# EAGLE design VentilationsEvaluationDevBoard_v2.1.3 (EAGLE 9.6.2)
TEST: 1234

## Sheet 1 of 3
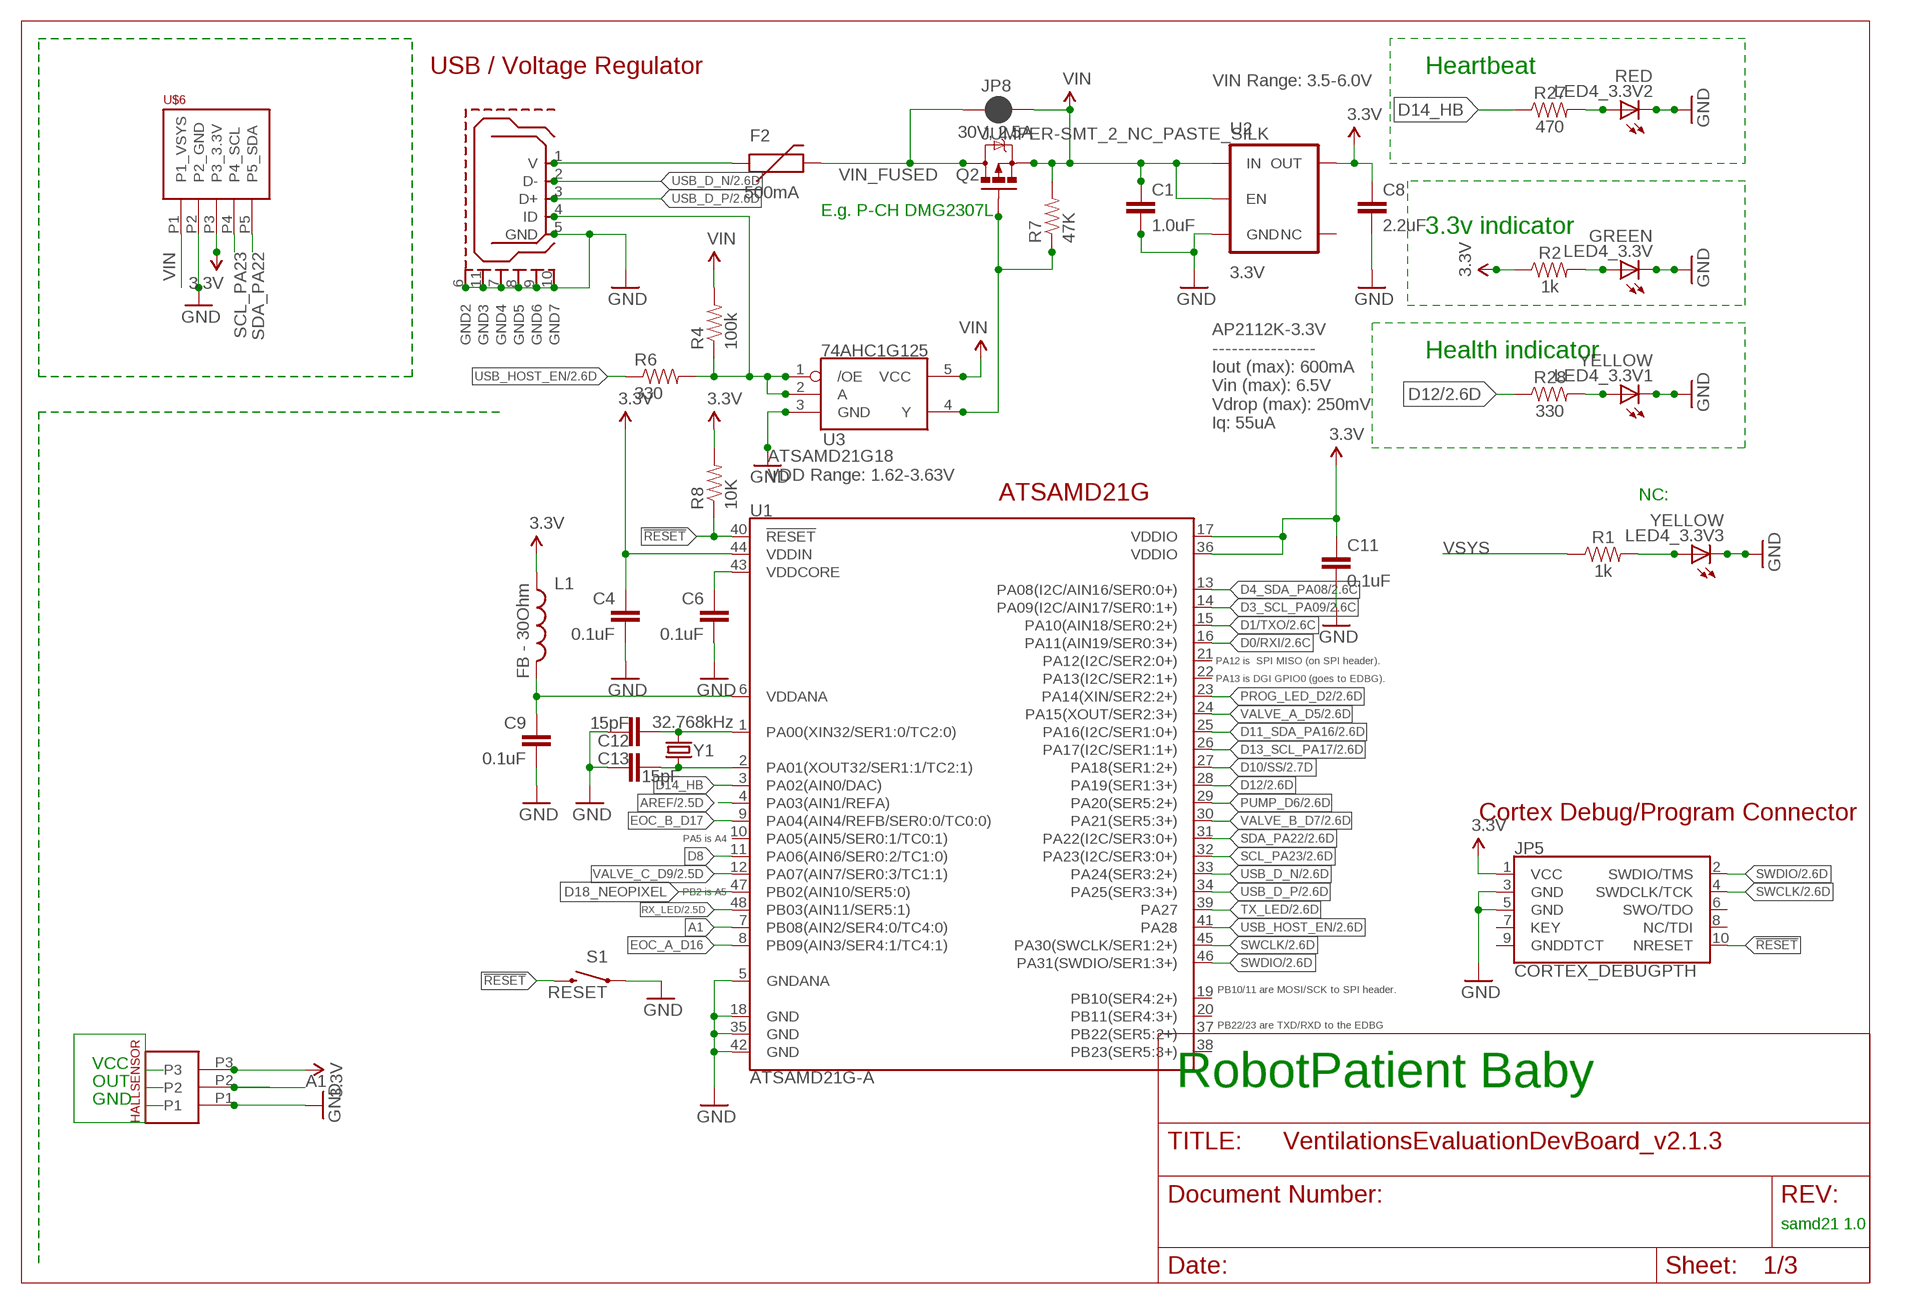
[diagram p0: schematic, sheet 1]

### Parts
798-ZX62-B-5PA11  USB_MICROB  [USB_MICROB_PACKAGE]
C1  1.0uF  1.0UF-25V-+80/-20(0805)  [0805]
C4  0.1uF  0.1UF-16V(+-10%)(0402)  [0402-CAP]
C6  0.1uF  0.1UF-16V(+-10%)(0402)  [0402-CAP]
C8  2.2uF  2.2UF-10V-20%(0603)  [0603-CAP]
C9  0.1uF  0.1UF-16V(+-10%)(0402)  [0402-CAP]
C11  0.1uF  0.1UF-16V(+-10%)(0402)  [0402-CAP]
C12  15pF  15PF-50V(+-5%)(0402)  [0402-CAP]
C13  15pF  15PF-50V(+-5%)(0402)  [0402-CAP]
F2  500mA  PTCSMD  [PTC-1206]
HALLSENSOR  PHOENIX_PTSM_M3_TH_UP  [PTSM_M3_THR_UP]
JP5  CORTEX_DEBUGPTH  [2X5-PTH-1.27MM]
JP8  JUMPER-SMT_2_NC_PASTE_SILK  [SMT-JUMPER_2_NC_PASTE_SILK]
L1  FB - 30Ohm  INDUCTOR0603  [0603]
LED4_3.3V  GREEN  LED0603  [LED-0603]
LED4_3.3V1  YELLOW  LED0603  [LED-0603]
LED4_3.3V2  RED  LED0603  [LED-0603]
LED4_3.3V3  YELLOW  LED0603  [LED-0603]
Q2  30V, 2.5A  MOSFET-PCHANNELDMG2307L  [SOT23-3]
R1  1k  1KOHM-0603-1/10W-1%  [0603]
R2  1k  1KOHM-0603-1/10W-1%  [0603]
R4  100k  100KOHM-1/10W-1%(0603)  [0603-RES]
R6  330  330OHM1/10W1%(0603)  [0603-RES]
R7  47K  47KOHM1/10W1%(0603)  [0603-RES]
R8  10K  10KOHM-1/10W-1%(0603)0603  [0603-RES]
R27  470  470OHM-0603-1/10W-1%  [0603]
R28  330  330OHM-0603-1/10W-1%  [0603]
S1  RESET  SWITCH-MOMENTARY-2SMD-4.6X2.8MM  [TACTILE_SWITCH_SMD_4.6X2.8MM]
U1  ATSAMD21G-A  [TQFP-48]
U2  3.3V  V_REG_AP2112K-3.3V  [SOT23-5]
U3  74AHC1G125  [SOT23-5]
U$6  PHOENIX_PTSM_M5_TH_UP  [PTSM_M5_THR_UP]
Y1  32.768kHz  CRYSTAL3.2X1.5MM  [CRYSTAL-SMD-3.2X1.5MM]

### Nets
3.3V [power]: C4.1 C8.1 C11.1 HALLSENSOR.P3 JP5.1(VCC) L1.1 R2.1 R8.2 U1.17(VDDIO) U1.36(VDDIO) U1.44(VDDIN) U2.5(OUT) U$6.P3(P3_3.3V) ; also sheet 2,3
!RESET: JP5.10(NRESET) R8.1 S1.3 S1.4 U1.40(!RESET!)
A1: HALLSENSOR.P2 U1.7(PB08(AIN2/SER4:0/TC4:0))
AREF: U1.4(PA03(AIN1/REFA)) ; also sheet 2
D0/RXI: U1.16(PA11(AIN19/SER0:3+)) ; also sheet 2
D1/TXO: U1.15(PA10(AIN18/SER0:2+)) ; also sheet 2
D3_SCL_PA09: U1.14(PA09(I2C/AIN17/SER0:1+)) ; also sheet 2,3
D4_SDA_PA08: U1.13(PA08(I2C/AIN16/SER0:0+)) ; also sheet 2,3
D8: U1.11(PA06(AIN6/SER0:2/TC1:0))
D10/SS: U1.27(PA18(SER1:2+)) ; also sheet 2
D11_SDA_PA16: U1.25(PA16(I2C/SER1:0+)) ; also sheet 2,3
D12: R28.1 U1.28(PA19(SER1:3+)) ; also sheet 2
D13_SCL_PA17: U1.26(PA17(I2C/SER1:1+)) ; also sheet 2,3
D14_HB: R27.1 U1.3(PA02(AIN0/DAC))
D18_NEOPIXEL: U1.47(PB02(AIN10/SER5:0))
EOC_A_D16: U1.8(PB09(AIN3/SER4:1/TC4:1)) ; also sheet 3
EOC_B_D17: U1.9(PA04(AIN4/REFB/SER0:0/TC0:0)) ; also sheet 3
GND [ground]: 798-ZX62-B-5PA11.5(GND) 798-ZX62-B-5PA11.6(GND2) 798-ZX62-B-5PA11.7(GND4) 798-ZX62-B-5PA11.8(GND5) 798-ZX62-B-5PA11.9(GND6) 798-ZX62-B-5PA11.10(GND7) 798-ZX62-B-5PA11.11(GND3) C1.2 C4.2 C6.2 C8.2 C9.2 C11.2 C12.1 C13.2 HALLSENSOR.P1 JP5.3(GND) JP5.5(GND) LED4_3.3V1.C LED4_3.3V2.C LED4_3.3V3.C LED4_3.3V.C S1.1 S1.2 U1.5(GNDANA) U1.18(GND) U1.35(GND) U1.42(GND) U2.2(GND) U3.3(GND) U$6.P2(P2_GND) ; also sheet 2,3
N$1: LED4_3.3V2.A R27.2
N$2: LED4_3.3V1.A R28.2
N$3: LED4_3.3V3.A R1.2
N$8: C12.2 U1.1(PA00(XIN32/SER1:0/TC2:0)) Y1.P$2
N$9: 798-ZX62-B-5PA11.1(V) F2.1
N$11: 798-ZX62-B-5PA11.4(ID) R4.1 R6.2 U3.1(/OE) U3.2(A)
N$12: Q2.1(G) R7.1 U3.4(Y)
N$13: C13.1 U1.2(PA01(XOUT32/SER1:1/TC2:1)) Y1.P$1
N$33: LED4_3.3V.A R2.2
PROG_LED_D2: U1.23(PA14(XIN/SER2:2+)) ; also sheet 2
PUMP_D6: U1.29(PA20(SER5:2+)) ; also sheet 2,3
RX_LED: U1.48(PB03(AIN11/SER5:1)) ; also sheet 2
SCL_PA23: U1.32(PA23(I2C/SER3:0+)) U$6.P4(P4_SCL) ; also sheet 2
SDA_PA22: U1.31(PA22(I2C/SER3:0+)) U$6.P5(P5_SDA) ; also sheet 2
SWCLK: JP5.4(SWDCLK/TCK) U1.45(PA30(SWCLK/SER1:2+)) ; also sheet 2
SWDIO: JP5.2(SWDIO/TMS) U1.46(PA31(SWDIO/SER1:3+)) ; also sheet 2
TX_LED: U1.39(PA27) ; also sheet 2
USB_D_N [diff_pair]: 798-ZX62-B-5PA11.2(D-) U1.33(PA24(SER3:2+)) ; also sheet 2
USB_D_P [diff_pair]: 798-ZX62-B-5PA11.3(D+) U1.34(PA25(SER3:3+)) ; also sheet 2
USB_HOST_EN: R6.1 U1.41(PA28) ; also sheet 2
VALVE_A_D5: U1.24(PA15(XOUT/SER2:3+)) ; also sheet 2,3
VALVE_B_D7: U1.30(PA21(SER5:3+)) ; also sheet 2,3
VALVE_C_D9: U1.12(PA07(AIN7/SER0:3/TC1:1)) ; also sheet 2,3
VDDANA [power]: C9.1 L1.2 U1.6(VDDANA)
VDDCORE [power]: C6.1 U1.43(VDDCORE)
VIN [power]: C1.1 JP8.2 Q2.2(S) R4.2 R7.2 U2.1(IN) U2.3(EN) U3.5(VCC) U$6.P1(P1_VSYS) ; also sheet 2
VIN_FUSED [power]: F2.2 JP8.1 Q2.3(D) ; also sheet 2
VSYS [power]: R1.1 ; also sheet 2
Unconnected: JP5.6(SWO/TDO) JP5.7(KEY) JP5.8(NC/TDI) JP5.9(GNDDTCT) U1.10(PA05(AIN5/SER0:1/TC0:1)) U1.19(PB10(SER4:2+)) U1.20(PB11(SER4:3+)) U1.21(PA12(I2C/SER2:0+)) U1.22(PA13(I2C/SER2:1+)) U1.37(PB22(SER5:2+)) U1.38(PB23(SER5:3+)) U2.4(NC)

### Notes on the sheet
- USB / Voltage Regulator
- VIN Range: 3.5-6.0V | Heartbeat
- E.g. P-CH DMG2307L
- 3.3v indicator
- AP2112K-3.3V
  ----------------
  Iout (max): 600mA 
  Vin (max): 6.5V
  Vdrop (max): 250mV
  Iq: 55uA
- Health indicator
- ATSAMD21G18
  VDD Range: 1.62-3.63V
- ATSAMD21G
- NC:
- PA12 is  SPI MISO (on SPI header).
- PA13 is DGI GPIO0 (goes to EDBG).
- Cortex Debug/Program Connector
- PA5 is A4
- PB2 is A5
- PB10/11 are MOSI/SCK to SPI header.
- PB22/23 are TXD/RXD to the EDBG
- VCC
- OUT | RobotPatient Baby
- GND
- samd21 1.0

## Sheet 2 of 3
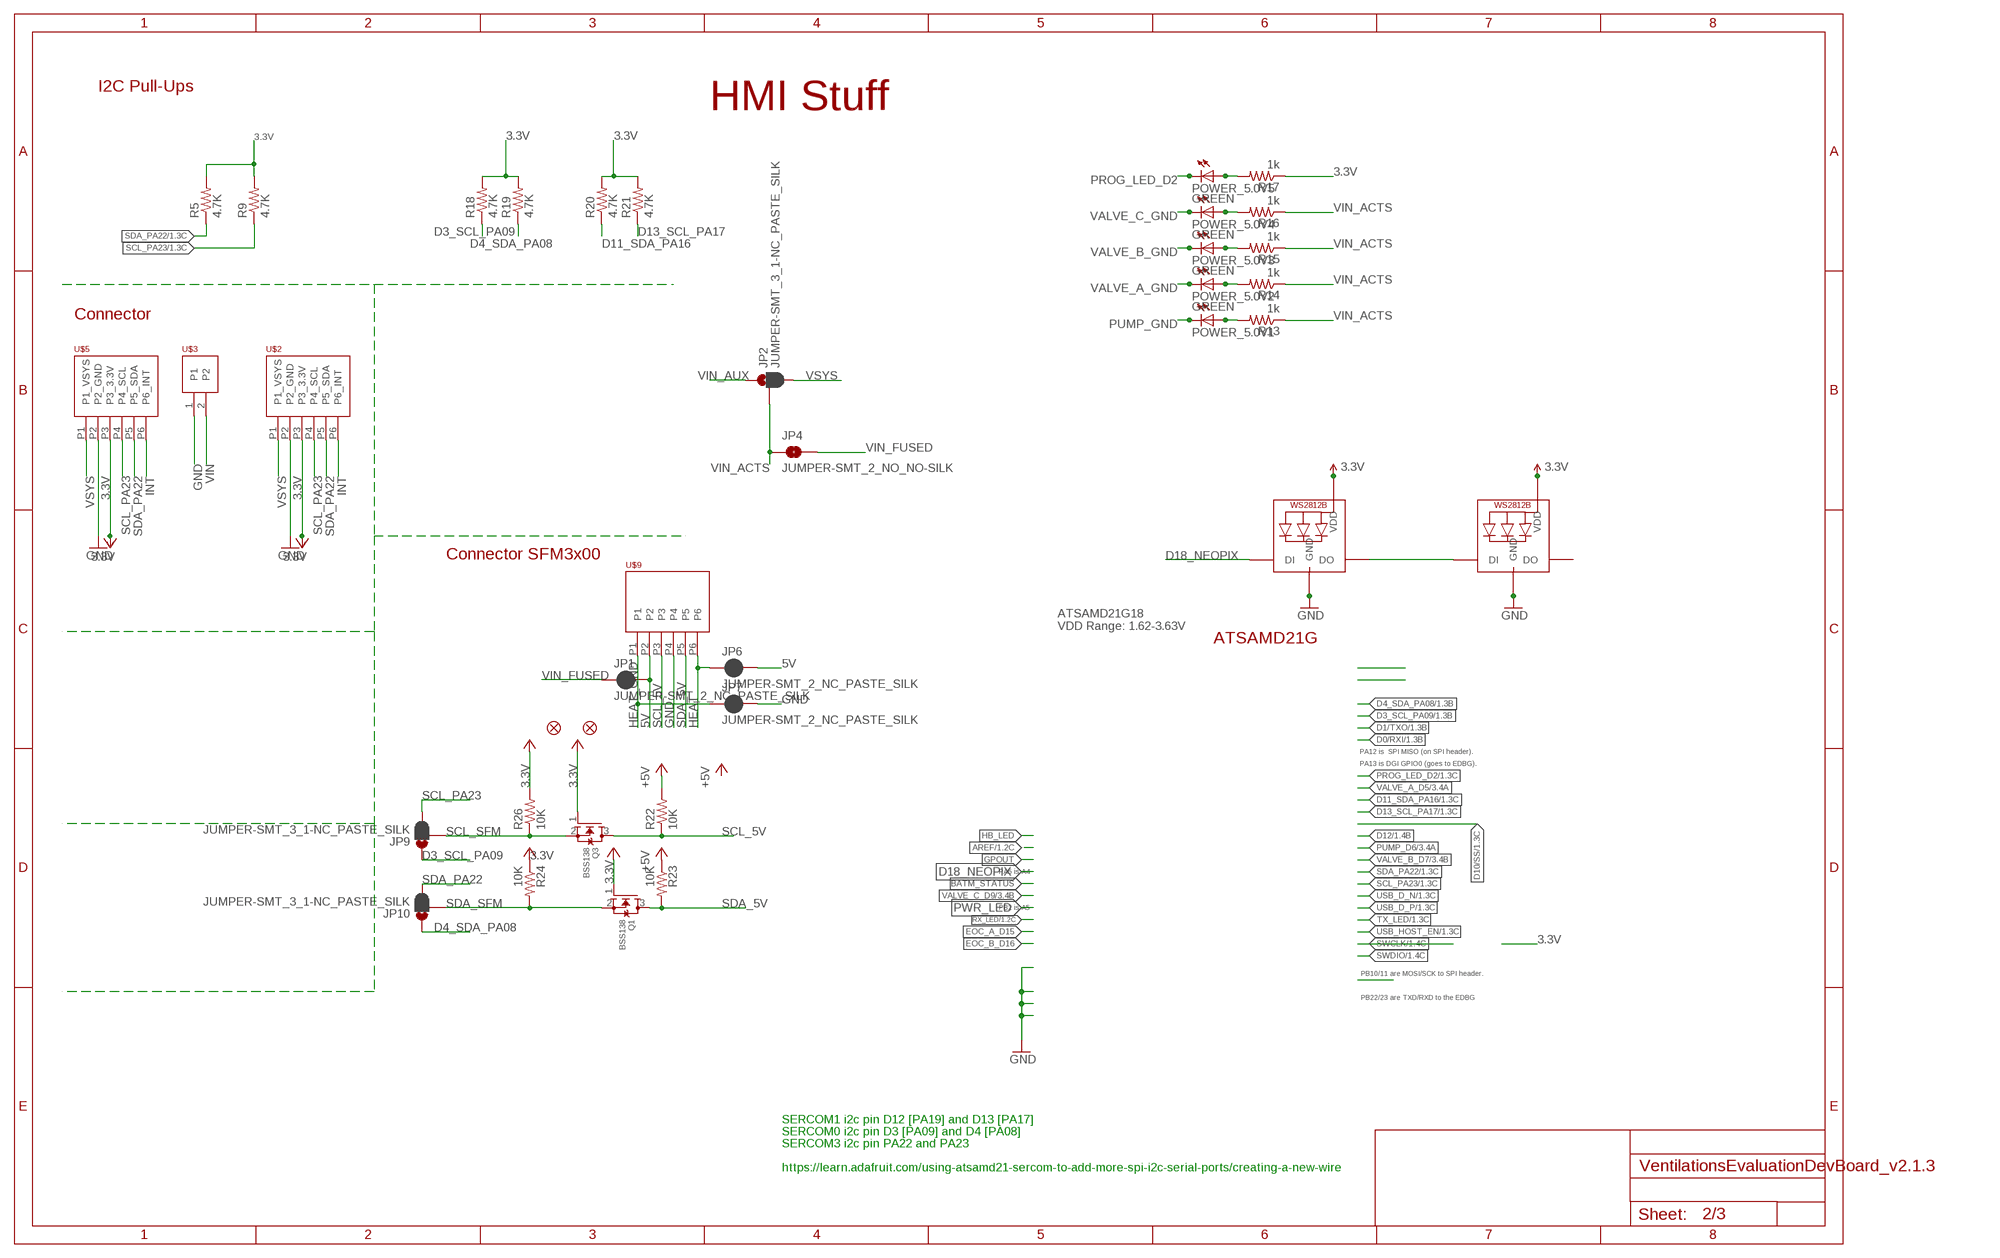
[diagram p1: schematic, sheet 2]

### Parts
FD1  FIDUCIAL1X2  [FIDUCIAL-1X2]
FD2  FIDUCIAL1X2  [FIDUCIAL-1X2]
JP1  JUMPER-SMT_2_NC_PASTE_SILK  [SMT-JUMPER_2_NC_PASTE_SILK]
JP2  JUMPER-SMT_3_1-NC_PASTE_SILK  [SMT-JUMPER_3_1-NC_PASTE_SILK]
JP4  JUMPER-SMT_2_NO_NO-SILK  [SMT-JUMPER_2_NO_NO-SILK]
JP6  JUMPER-SMT_2_NC_PASTE_SILK  [SMT-JUMPER_2_NC_PASTE_SILK]
JP7  JUMPER-SMT_2_NC_PASTE_SILK  [SMT-JUMPER_2_NC_PASTE_SILK]
JP9  JUMPER-SMT_3_1-NC_PASTE_SILK  [SMT-JUMPER_3_1-NC_PASTE_SILK]
JP10  JUMPER-SMT_3_1-NC_PASTE_SILK  [SMT-JUMPER_3_1-NC_PASTE_SILK]
LED1  WS2812B3535  [LED3535]
LED2  WS2812B3535  [LED3535]
POWER_5.0V1  GREEN  LED0603  [LED-0603]
POWER_5.0V2  GREEN  LED0603  [LED-0603]
POWER_5.0V3  GREEN  LED0603  [LED-0603]
POWER_5.0V4  GREEN  LED0603  [LED-0603]
POWER_5.0V5  GREEN  LED0603  [LED-0603]
Q1  BSS138  MOSFET-NREFLOW  [SOT23]
Q3  BSS138  MOSFET-NREFLOW  [SOT23]
R5  4.7K  4.7KOHM-1/10W-1%(0603)  [0603-RES@1]
R9  4.7K  4.7KOHM-1/10W-1%(0603)  [0603-RES@1]
R13  1k  10KOHM-1/10W-1%(0603)0603  [0603-RES]
R14  1k  10KOHM-1/10W-1%(0603)0603  [0603-RES]
R15  1k  10KOHM-1/10W-1%(0603)0603  [0603-RES]
R16  1k  10KOHM-1/10W-1%(0603)0603  [0603-RES]
R17  1k  10KOHM-1/10W-1%(0603)0603  [0603-RES]
R18  4.7K  4.7KOHM-1/10W-1%(0603)  [0603-RES@1]
R19  4.7K  4.7KOHM-1/10W-1%(0603)  [0603-RES@1]
R20  4.7K  4.7KOHM-1/10W-1%(0603)  [0603-RES@1]
R21  4.7K  4.7KOHM-1/10W-1%(0603)  [0603-RES@1]
R22  10K  R-US_R0805  [R0805]
R23  10K  R-US_R0805  [R0805]
R24  10K  R-US_R0805  [R0805]
R26  10K  R-US_R0805  [R0805]
U$2  PHOENIX_PTSM_M6_TH_I2CPPANGLE  [PTSM_M6_THRHOLE]
U$3  PHOENIX_PTSM_M2_TH  [PTSM_M2_THRHOLE]
U$5  PHOENIX_PTSM_M6_TH_I2CPPANGLE  [PTSM_M6_THRHOLE]
U$9  PHOENIX_PTSM_M6_TH_UP_NEUTRAL  [PTSM_M6_TH_UP_NEUTRAL]

### Nets
3.3V [power]: LED1.2(VDD) LED2.2(VDD) Q1.1(G) Q3.1(G) R5.2 R9.2 R17.1 R18.2 R19.2 R20.2 R21.2 R24.1 R26.2 U$2.P3(P3_3.3V) U$5.P3(P3_3.3V) ; supply symbol labelled +3V3 ; also sheet 1,3
5V [power]: JP1.2 JP6.2 R22.2 R23.1 U$9.P2 ; supply symbol labelled +5V
D3_SCL_PA09: JP9.1 R18.1 ; also sheet 1,3
D4_SDA_PA08: JP10.1 R19.1 ; also sheet 1,3
D11_SDA_PA16: R20.1 ; also sheet 1,3
D13_SCL_PA17: R21.1 ; also sheet 1,3
D18_NEOPIX: LED1.1(DI)
GND [ground]: JP7.2 LED1.4(GND) LED2.4(GND) U$2.P2(P2_GND) U$3.1 U$5.P2(P2_GND) U$9.P4 ; also sheet 1,3
HEAT [power]: JP6.1 U$9.P6
HEAT_GND [ground]: JP7.1 U$9.P1
INT: U$2.P6(P6_INT) U$5.P6(P6_INT)
N$24: POWER_5.0V1.A R13.2
N$25: POWER_5.0V2.A R14.2
N$26: LED1.3(DO) LED2.1(DI)
N$27: POWER_5.0V3.A R15.2
N$28: POWER_5.0V4.A R16.2
N$29: POWER_5.0V5.A R17.2
PROG_LED_D2: POWER_5.0V5.C ; also sheet 1
PUMP_GND [ground]: POWER_5.0V1.C ; also sheet 3
SCL_5V: Q3.3(D) R22.1 U$9.P3
SCL_PA23: JP9.3 R9.1 U$2.P4(P4_SCL) U$5.P4(P4_SCL) ; also sheet 1
SCL_SFM: JP9.2 Q3.2(S) R26.1
SDA_5V: Q1.3(D) R23.2 U$9.P5
SDA_PA22: JP10.3 R5.1 U$2.P5(P5_SDA) U$5.P5(P5_SDA) ; also sheet 1
SDA_SFM: JP10.2 Q1.2(S) R24.2
VALVE_A_GND [ground]: POWER_5.0V2.C ; also sheet 3
VALVE_B_GND [ground]: POWER_5.0V3.C ; also sheet 3
VALVE_C_GND [ground]: POWER_5.0V4.C ; also sheet 3
VIN [power]: U$3.2 ; also sheet 1
VIN_ACTS [power]: JP2.2 JP4.1 R13.1 R14.1 R15.1 R16.1 ; also sheet 3
VIN_AUX: JP2.1
VIN_FUSED [power]: JP1.1 JP4.2 ; also sheet 1
VSYS [power]: JP2.3 U$2.P1(P1_VSYS) U$5.P1(P1_VSYS) ; also sheet 1
Unconnected: LED2.3(DO)

### Notes on the sheet
- I2C Pull-Ups | HMI Stuff
- Connector
- Connector SFM3x00
- ATSAMD21G18
  VDD Range: 1.62-3.63V
- ATSAMD21G
- PA12 is  SPI MISO (on SPI header).
- PA13 is DGI GPIO0 (goes to EDBG).
- PA5 is A4
- PB2 is A5
- PB10/11 are MOSI/SCK to SPI header.
- PB22/23 are TXD/RXD to the EDBG
- SERCOM1 i2c pin D12 [PA19] and D13 [PA17]
- SERCOM0 i2c pin D3 [PA09] and D4 [PA08]
- SERCOM3 i2c pin PA22 and PA23
- https://learn.adafruit.com/using-atsamd21-sercom-to-add-more-spi-i2c-serial-ports/creating-a-new-wire

## Sheet 3 of 3
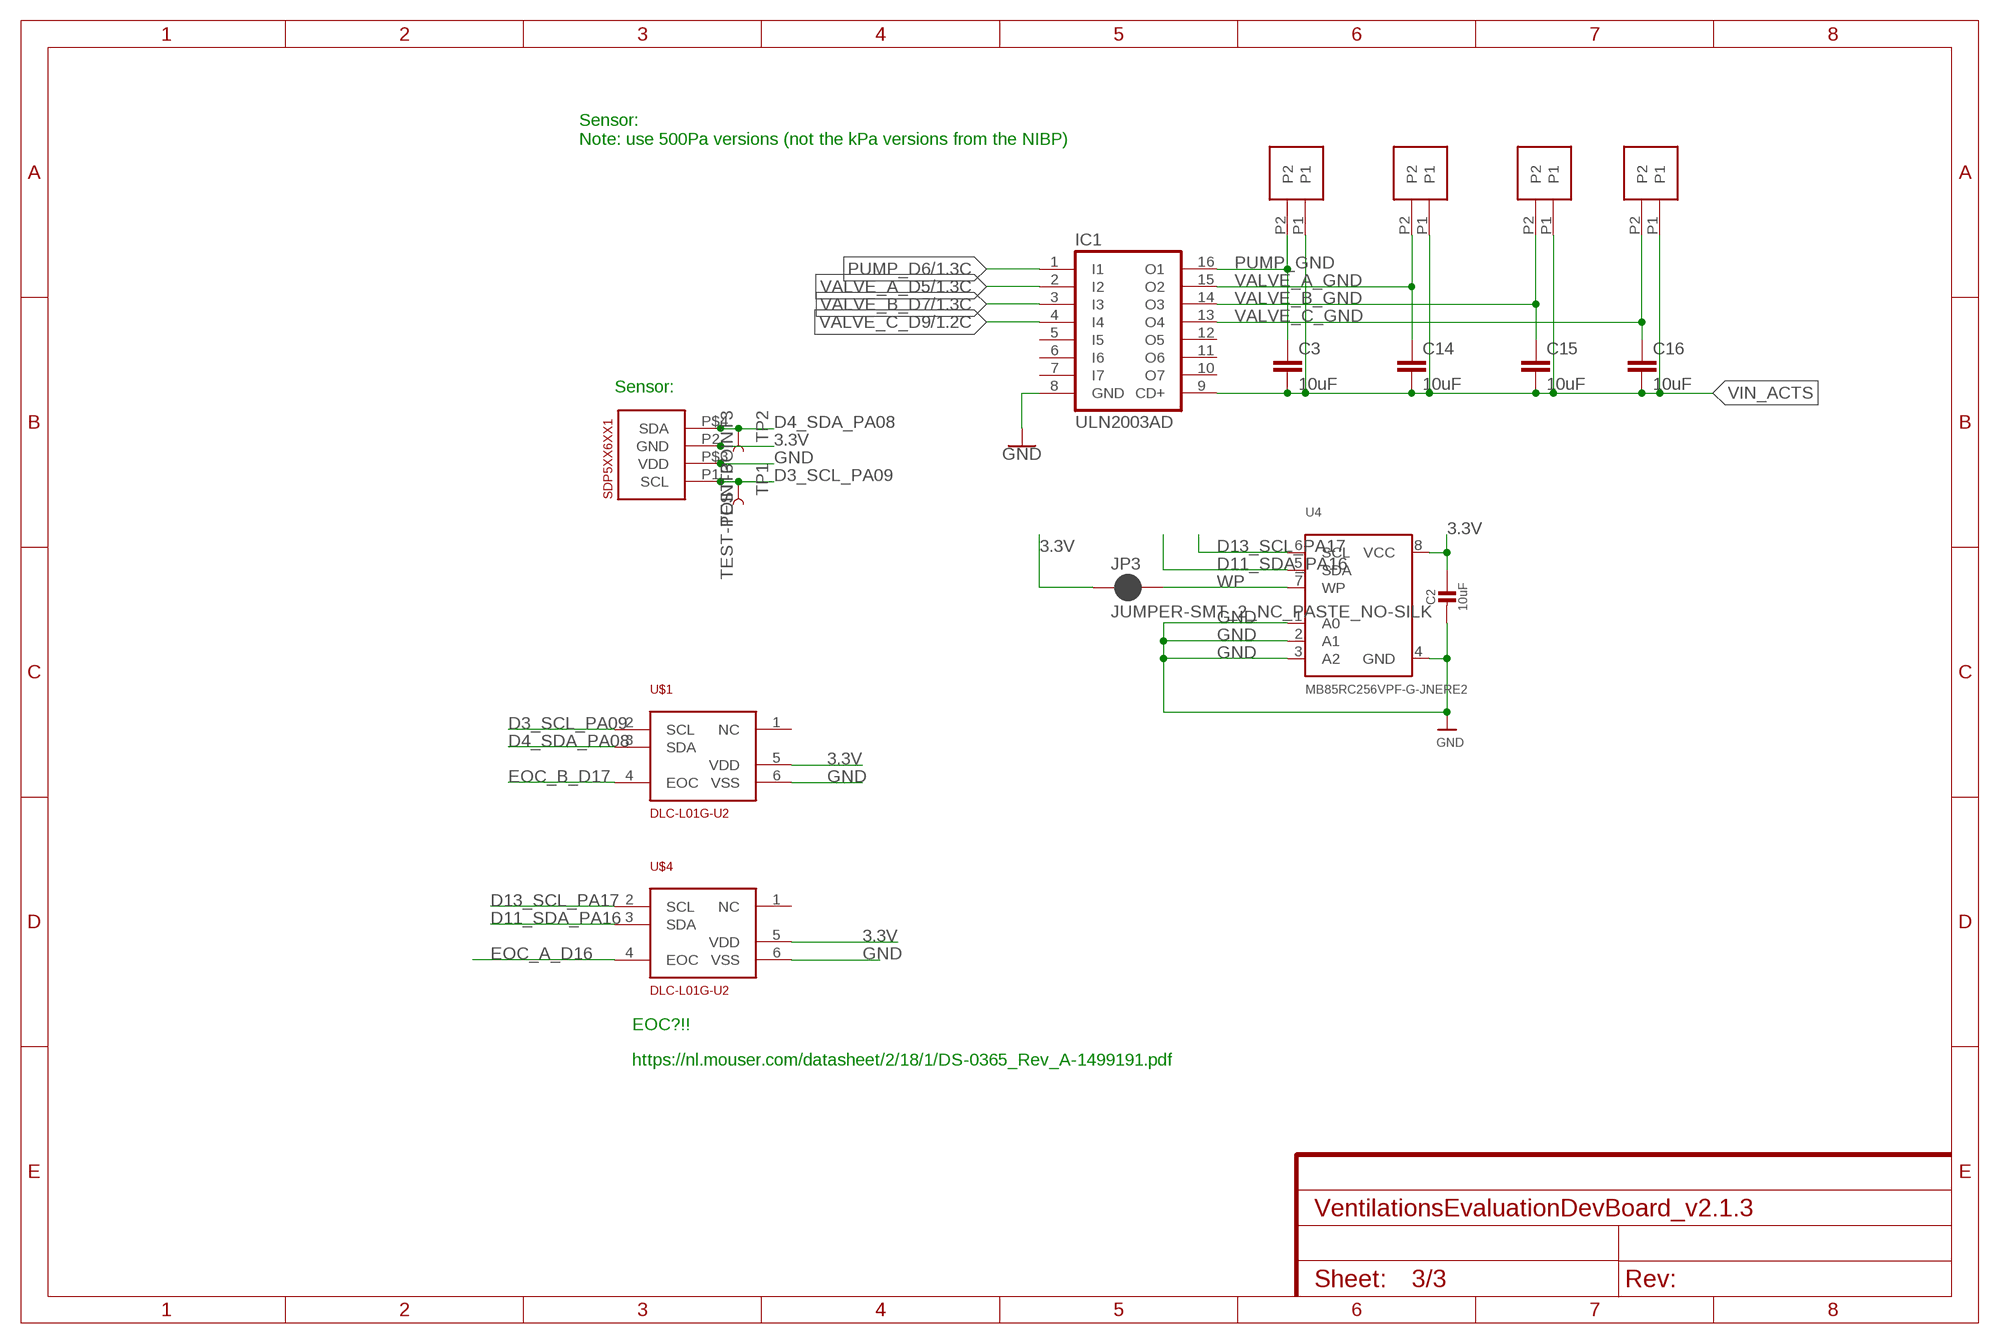
[diagram p2: schematic, sheet 3]

### Parts
C2  10uF  CAP_CERAMIC_0805MP  [_0805MP]
C3  10uF  10UF-0805-10V-10%  [0805]
C14  10uF  10UF-0805-10V-10%  [0805]
C15  10uF  10UF-0805-10V-10%  [0805]
C16  10uF  10UF-0805-10V-10%  [0805]
IC1  ULN2003AD  [SO16]
JP3  JUMPER-SMT_2_NC_PASTE_NO-SILK  [SMT-JUMPER_2_NC_PASTE_NO-SILK]
PUMP  PHOENIX_PTSM_M2_SMD  [PTSM_M2_SMD]
SDP5XX6XX1  SDP5XX_6XX  [SDP5XX_6XX]
TP1  TEST-POINT3  [PAD.03X.03]
TP2  TEST-POINT3  [PAD.03X.03]
U4  MB85RC256VPF-G-JNERE2  FRAM_SOIC8_I2C  [SOIC8_208MIL]
U$1  DLC-L01G-U2  [DLC-L01G-U2]
U$4  DLC-L01G-U2  [DLC-L01G-U2]
VALVE_A  PHOENIX_PTSM_M2_SMD  [PTSM_M2_SMD]
VALVE_B  PHOENIX_PTSM_M2_SMD  [PTSM_M2_SMD]
VALVE_C  PHOENIX_PTSM_M2_SMD  [PTSM_M2_SMD]

### Nets
3.3V [power]: C2.1 JP3.1 SDP5XX6XX1.P2(GND) U4.8(VCC) U$1.5(VDD) U$4.5(VDD) ; also sheet 1,2
D3_SCL_PA09: SDP5XX6XX1.P1(SCL) TP1.P$1 U$1.2(SCL) ; also sheet 1,2
D4_SDA_PA08: SDP5XX6XX1.P$4(SDA) TP2.P$1 U$1.3(SDA) ; also sheet 1,2
D11_SDA_PA16: U4.5(SDA) U$4.3(SDA) ; also sheet 1,2
D13_SCL_PA17: U4.6(SCL) U$4.2(SCL) ; also sheet 1,2
EOC_A_D16: U$4.4(EOC) ; also sheet 1
EOC_B_D17: U$1.4(EOC) ; also sheet 1
GND [ground]: C2.2 IC1.8(GND) SDP5XX6XX1.P$3(VDD) U4.1(A0) U4.2(A1) U4.3(A2) U4.4(GND) U$1.6(VSS) U$4.6(VSS) ; also sheet 1,2
PUMP_D6: IC1.1(I1) ; also sheet 1,2
PUMP_GND [ground]: C3.1 IC1.16(O1) PUMP.P2 ; also sheet 2
VALVE_A_D5: IC1.2(I2) ; also sheet 1,2
VALVE_A_GND [ground]: C14.1 IC1.15(O2) VALVE_A.P2 ; also sheet 2
VALVE_B_D7: IC1.3(I3) ; also sheet 1,2
VALVE_B_GND [ground]: C15.1 IC1.14(O3) VALVE_B.P2 ; also sheet 2
VALVE_C_D9: IC1.4(I4) ; also sheet 1,2
VALVE_C_GND [ground]: C16.1 IC1.13(O4) VALVE_C.P2 ; also sheet 2
VIN_ACTS [power]: C3.2 C14.2 C15.2 C16.2 IC1.9(CD+) PUMP.P1 VALVE_A.P1 VALVE_B.P1 VALVE_C.P1 ; also sheet 2
WP: JP3.2 U4.7(WP)
Unconnected: IC1.5(I5) IC1.6(I6) IC1.7(I7) IC1.10(O7) IC1.11(O6) IC1.12(O5) U$1.1(NC) U$4.1(NC)

### Notes on the sheet
- Sensor:
  Note: use 500Pa versions (not the kPa versions from the NIBP)
- Sensor:
- EOC?!!
- https://nl.mouser.com/datasheet/2/18/1/DS-0365_Rev_A-1499191.pdf

## Library data of the parts
798-ZX62-B-5PA11 = femtoduino:USB_MICROB: This is the hirose ZX62-B-5PA(11) MICRO-USB B Type female connection.
C1 = SparkFun-Capacitors:1.0UF-25V-+80/-20(0805): CAP-11625; PROD_ID: CAP-11625
C2 = microbuilder:CAP_CERAMIC: Ceramic Capacitors For new designs, use the packages preceded by an '_' character since they are more reliable: The following footprints should be used on most boards: _0402 - Standard footprint for regular board layouts _0603 - Standard footprint for regular board layouts _0805 - Standard footprint for regular board layouts _1206 - Standard footprint for regular board layouts For extremely tight-pitch boards where space is at a premium, the following 'micro-pitch' footprints can be used (smaller pads, no silkscreen outline, etc.): _0402MP - Micro-pitch footprint for very dense/compact boards _0603MP - Micro-pitch footprint for very dense/compact boards _0805MP - Micro-pitch footprint for very dense/compact boards _1206MP - Micro-pitch footprint for very dense/compact boards
C3 C14-C16 = SparkFun-Capacitors:10UF: 10.0µF ceramic capacitors A capacitor is a passive two-terminal electrical component used to store electrical energy temporarily in an electric field.; PROD_ID: CAP-11330
C4 C6 C9 C11 = SparkFun-Capacitors:0.1UF-16V(+-10%)(0402); PROD_ID: CAP-12416
C8 = SparkFun-Capacitors:2.2UF-10V-20%(0603): CAP-07888; PROD_ID: CAP-07888
C12 C13 = samd21-temp:15PF-50V(+-5%)(0402); PROD_ID: CAP-13063
F2 = SparkFun-PowerIC:PTC: Resettable Fuse PTC Resettable Fuse. Spark Fun Electronics SKU : COM-08357; PROD_ID: RES-11150
FD1 FD2 = SparkFun-Aesthetics:FIDUCIAL: Fiducial Alignment Points Point-of-reference for pick-and-place machines and other optical instruments.
HALLSENSOR = jk_customs:PHOENIX_PTSM_M3_TH_UP
IC1 = uln-udn:ULN2003A: DRIVER ARRAY
JP1 JP3 JP6-JP8 = SparkFun-Jumpers:JUMPER-SMT_2_NC_PASTE: Normally closed solder jumper This jumper has an aperture in the stencil to allow solder paste to bridge the split in the wire so it's normally closed (NC). Wick off the solder to open the connection. Reapply solder to reclose the connection.
JP2 JP9 JP10 = SparkFun-Jumpers:JUMPER-SMT_3_1-NC_PASTE: Normally closed solder jumper (1 of 2 connections) This jumper has an aperture in the stencil to allow solder paste to bridge one of the two connections. One connection is normally closed (NC), while the other is normally open (NO). Wick off the solder to open the connection. Reapply solder to reclose the connection. Apply solder to the other side instead to change the current path.
JP4 = SparkFun-Jumpers:JUMPER-SMT_2_NO: Normally open jumper This jumper has two pads in close proximity to each other. Apply solder to close the connection. Round pads are easier to solder for beginners, but are a lot larger. SparkFun Product that uses the round pads: SparkFun EL Sequencer <https://www.sparkfun.com/products/12781>
JP5 = samd21-temp:CORTEX_DEBUG: Cortex Debug Connector Datasheet <http://infocenter.arm.com/help/topic/com.arm.doc.faqs/attached/13634/cortex_debug_connectors.pdf>
L1 = SparkFun-Passives:INDUCTOR: Inductors Basic Inductor/Choke - 0603 and 1206. Footprints are not proven and vary greatly between part numbers. SRN6045- 33uH, 20% 1.4A SDR0403-560KL - 56uH, 10%, 500mA RMS/740mA peak; PROD_ID: RES-07859
LED1 LED2 = microbuilder:WS2812B
LED4_3.3V LED4_3.3V1-LED4_3.3V3 POWER_5.0V1-POWER_5.0V5 = SparkFun:LED: LEDs Standard schematic elements and footprints for 5mm, 3mm, 1206, and 0603 sized LEDs. 5mm - Spark Fun Electronics SKU : COM-00529 (and others)
PUMP VALVE_A VALVE_B VALVE_C = jk_customs:PHOENIX_PTSM_M2_SMD
Q1 Q3 = adafruit:MOSFET-N: N-Channel Mosfet 2N7002E - 60V 260mA SOT23 [Digikey: 2N7002ET1GOSTR-ND] - REEL BSH103 - 30V 850mA SOT23 [Digikey: 568-5013-1-ND]
Q2 = SparkFun-DiscreteSemi:MOSFET-PCHANNEL: Generic PMOSFET IRLML2244 - TRANS-11153 (SOT-23 -20V -4.3A) (1.Gate 2.Source 3.Drain) FQP27P06 - COM-10349 <http://www.sparkfun.com/products/10349> (TO-220 -60V -27A) (1.Gate 2.Source 3.Drain); PROD_ID: TRANS-11308
R1 R2 = SparkFun-Resistors:1KOHM: 1kΩ resistor A resistor is a passive two-terminal electrical component that implements electrical resistance as a circuit element. Resistors act to reduce current flow, and, at the same time, act to lower voltage levels within circuits. - Wikipedia; PROD_ID: RES-07856
R4 = SparkFun-Resistors:100KOHM-1/10W-1%(0603): RES-07828; PROD_ID: RES-07828
R5 R9 R18-R21 = SparkFun-Resistors:4.7KOHM-1/10W-1%(0603): RES-07857; PROD_ID: RES-07857
R6 = SparkFun-Resistors:330OHM1/10W1%(0603): RES-00818; PROD_ID: RES-00818
R7 = SparkFun-Resistors:47KOHM1/10W1%(0603): RES-07871; PROD_ID: RES-07871
R8 = SparkFun-Resistors:10KOHM-1/10W-1%(0603): RES-00824; PROD_ID: RES-00824
R13-R17 = SparkFun-Resistors:10KOHM-1/10W-1%(0603): RES-00824; PROD_ID: RES-00824; VALUE: 10K
R22-R24 R26 = adafruit:R-US_: RESISTOR, American symbol
R27 = SparkFun-Resistors:470OHM: 470Ω resistor A resistor is a passive two-terminal electrical component that implements electrical resistance as a circuit element. Resistors act to reduce current flow, and, at the same time, act to lower voltage levels within circuits. - Wikipedia; PROD_ID: RES-07869
R28 = SparkFun-Resistors:330OHM: 330Ω resistor A resistor is a passive two-terminal electrical component that implements electrical resistance as a circuit element. Resistors act to reduce current flow, and, at the same time, act to lower voltage levels within circuits. - Wikipedia; PROD_ID: RES-00818
S1 = samd21-temp:SWITCH-MOMENTARY-2: Various NO switches- pushbuttons, reed, etc; PROD_ID: SWCH-13065
SDP5XX6XX1 = jk_customs:SDP5XX_6XX: Sensirion SDP600 Series (SDP6xx/5xx) Low-cost Digital Differential Pressure Sensor
TP1 TP2 = SparkFun-Connectors:TEST-POINT: SparkFun Test Points Bare copper test points for troubleshooting or In-Circuit-Testing. These are used by our Production team for verifying production board runs using pogo-pins on test beds. SparkFun Products: SparkFun LSM9DS1 Breakout <https://www.sparkfun.com/products/13284> SparkFun PSOC <https://www.sparkfun.com/products/13714> SparkFun Load Cell Amplifier <https://www.sparkfun.com/products/13879>
U1 = samd21-temp:ATSAMD21G: Atmel SAMD21G SMART ARM-Based Microcontroller The Atmel ® | SMART ™ SAM D21 is a series of low-power microcontrollers using the 32-bit ARM ® Cortex ® -M0+ processor, and ranging from 32- to 64-pins with up to 256KB Flash and 32KB of SRAM. The SAM D21 devices operate at a maximum frequency of 48MHz and reach 2.46 CoreMark/MHz. They are designed for simple and intuitive migration with identical peripheral modules, hex compatible code, identical linear address map and pin compatible migration paths between all devices in the product series. All devices include intelligent and flexible peripherals, Atmel Event System for inter-peripheral signaling, and support for capacitive touch button, slider and wheel user interfaces.; PROD_ID: IC-13064
U2 = SparkFun-PowerIC:V_REG_AP2112: AP2112 - 600mA CMOS LDO Regulator w/ Enable The AP2112 is CMOS process low dropout linear regulator with enable function, the regulator delivers a guaranteed 600mA (min.) continuous load current. Features Output Voltage Accuracy: ±1.5% Output Current: 600mA (Min.) Foldback Short Current Protection: 50mA Enable Function to Turn ON/OFF VOUT Low Dropout Voltage (3.3V): 250mV (Typ.) @IOUT=600mA Excellent Load Regulation: 0.2%/A (Typ.) Excellent Line Regulation: 0.02%/V (Typ.) Low Quiescent Current: 55μA (Typ.) Low Standby Current: 0.01μA (Typ.) Low Output Noise: 50μVRMS PSRR: 100Hz -65dB, 1kHz -65dB OTSD Protection Stable with 1.0μF Flexible Cap: Ceramic, Tantalum and Aluminum Electrolytic Operation Temperature Range: -40°C to 85°C ESD: MM 400V, HBM 4000V; PROD_ID: VREG-12457
U3 = SparkFun-DigitalIC:74AHC1G125: Single bus buffer gate with 3-state output
U4 = microbuilder:FRAM_SOIC8_I2C: I2C FRAM - SOIC8 Package 256KBit (32Kx8) - MB85RC256VPF-G-JNERE2 - SOIC-8 200 Mil, 2.7-5.5V, -40°C-85°C
U$1 U$4 = jk_customs:DLC-L01G-U2
U$2 U$5 = jk_customs:PHOENIX_PTSM_M6_TH_I2CPP
U$3 = jk_customs:PHOENIX_PTSM_M2_TH
U$6 = jk_customs:PHOENIX_PTSM_M5_TH_UP: Datasheet <https://www.phoenixcontact.com/online/portal/us?uri=pxc-oc-itemdetail:pid=1778586&library=usen&pdfmode=direct&pdflanguage=en>
U$9 = jk_customs:PHOENIX_PTSM_M6_TH_UP_NEUTRAL
Y1 = samd21-temp:CRYSTAL: Various standard crystals. Proven footprints.; PROD_ID: XTAL-13062

## Net classes
0 default: width 0.152 mm, drill 0.254 mm, clearance 0.152 mm
2 ground: width 0.254 mm, drill 0.254 mm, clearance 0.152 mm
3 power: width 0.254 mm, drill 0.254 mm, clearance 0.152 mm

## Board
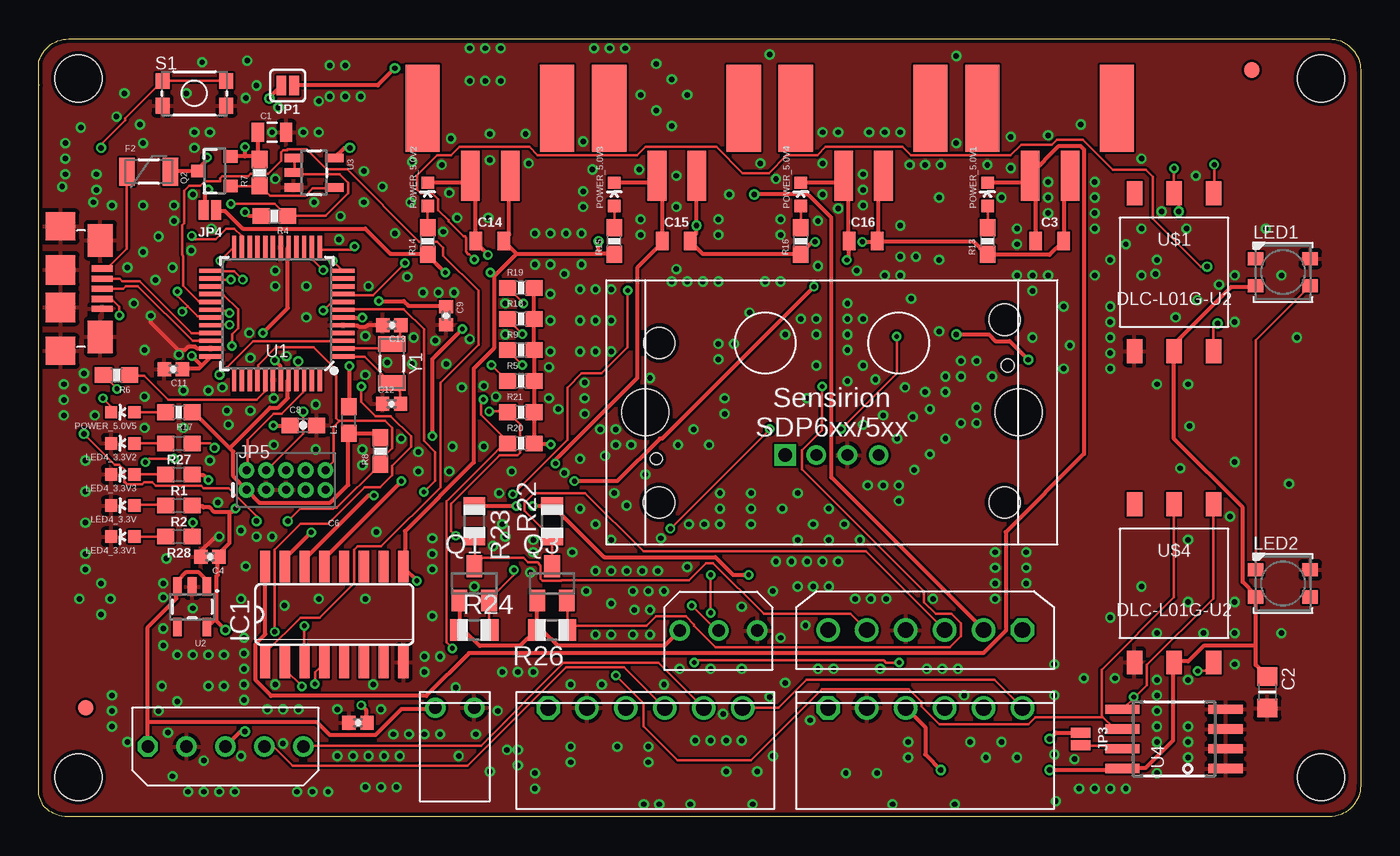
[diagram p3: board, top side]
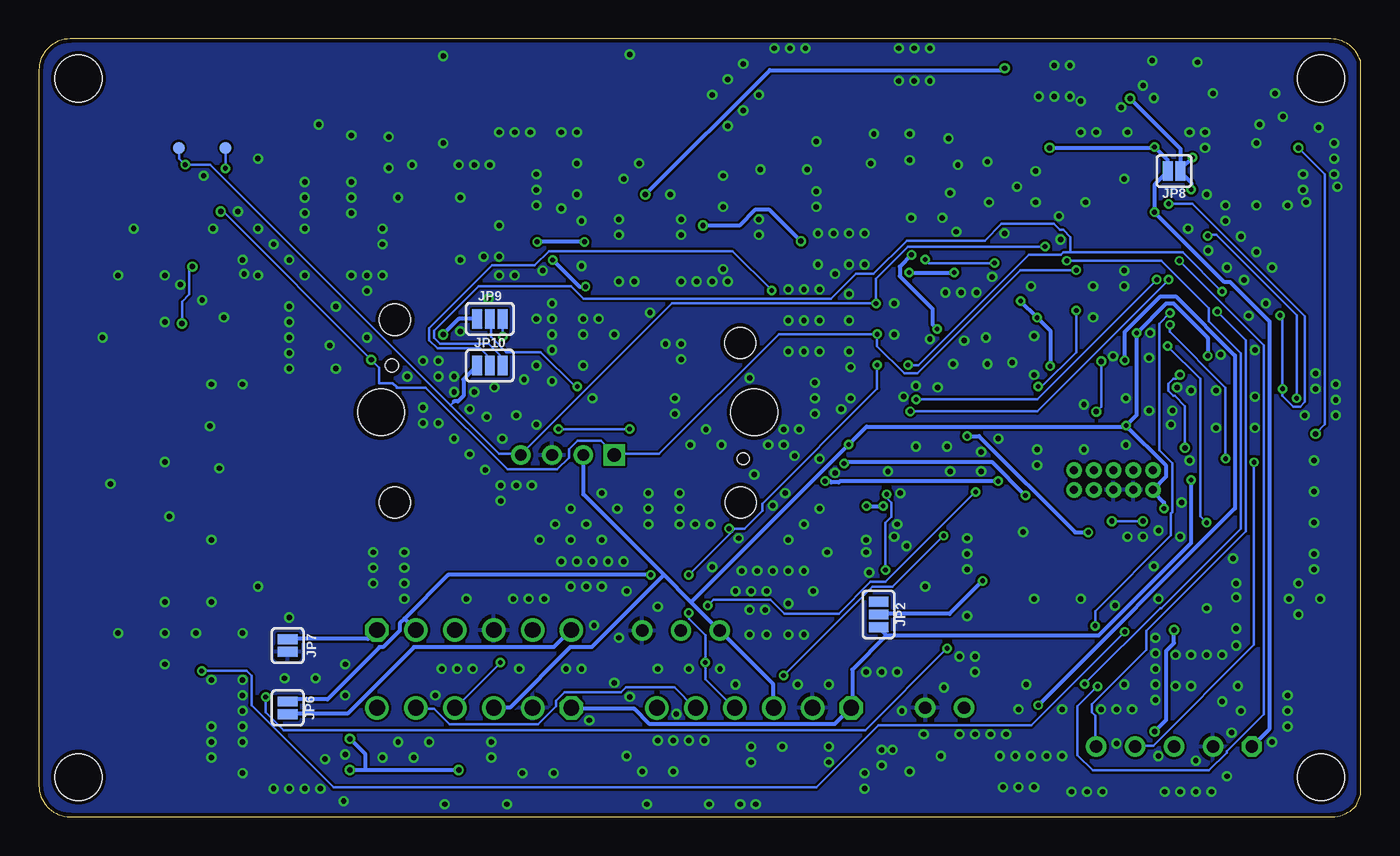
[diagram p4: board, bottom side, seen from below]

Size 85 x 50 mm. Coordinates in mm from the lower left corner, seen from the top.
Outline: 0.01,47.01 0.01,47.01
Outline: 0,48.59 0.07,48.77 arc-67 1.92,50 83,50 arc-90 85,48 85,2 arc-90 83,0 1.83,0 arc-45 0.41,0.59 0.29,0.71 0,1.41 0,48.59
Copper layers (1*16): Top 0.035mm / dielectric 1.5mm / Bottom 0.035mm
Design rules "ITEADstudio_DRC_Recent_june2014": minimum track width 6mil, minimum drill 12mil, track to track 6mil, track to pad 6mil, pad to pad 6mil, via to via 6mil, smd to smd 0mil, copper to edge 10mil, drill to drill 10mil, minimum pad ring 10mil, minimum via ring 6mil, stop-mask expansion 2mil, vias tented up to drill 100mil, thermal gap 10mil
Holes 3 mm at 2.54,2.54 2.54,47.46 82.46,47.46 82.46,2.54

### Footprints (pad centres in the part's own frame; a part is rotated, then mirrored left to right if it is on the bottom)
USB_MICROB_PACKAGE = smd 0.4 x 1.35: 1 -1.3,-0.68; 2 -0.64,-0.68; 3 0,-0.68; 4 0.66,-0.68; 5 1.3,-0.68 | smd 2.1 x 1.6: 6 -3.1,-0.8; 11 3.1,-0.8 | smd 1.8 x 1.9: 7 -4,-3.35; 10 4,-3.35 | smd 1.9 x 1.9: 8 -1.2,-3.35; 9 1.2,-3.35
0805 = smd 0.8 x 1.2: 1 -0.9,0; 2 0.9,0
_0805MP = smd 1.2 x 1.3: 1 -1.016,0; 2 1.016,0
0402-CAP = smd 0.85 x 0.9: 1 -0.58,0; 2 0.58,0
0603-CAP = smd 1.1 x 1: 1 -0.85,0; 2 0.85,0
PTC-1206 = smd 1 x 1.8: 1 -1.4,0; 2 1.4,0
FIDUCIAL-1X2 = smd 1 x 1: 1 0,0
PTSM_M3_THR_UP = drill 0.8: P1 2.507,-0.04; P2 0.007,-0.04; P3 -2.493,-0.04
SO16 = smd 0.66 x 2.032: 1 -4.445,-3.073; 2 -3.175,-3.073; 3 -1.905,-3.073; 4 -0.635,-3.073; 5 0.635,-3.073; 6 1.905,-3.073; 7 3.175,-3.073; 8 4.445,-3.073; 9 4.445,3.073; 10 3.175,3.073; 11 1.905,3.073; 12 0.635,3.073; 13 -0.635,3.073; 14 -1.905,3.073; 15 -3.175,3.073; 16 -4.445,3.073
SMT-JUMPER_2_NC_PASTE_SILK = smd 0.635 x 1.27: 1 -0.406,0; 2 0.406,0
SMT-JUMPER_3_1-NC_PASTE_SILK = smd 0.635 x 1.27: 1 -0.813,0; 2 0,0; 3 0.813,0
SMT-JUMPER_2_NC_PASTE_NO-SILK = smd 0.635 x 1.27: 1 -0.406,0; 2 0.406,0
SMT-JUMPER_2_NO_NO-SILK = smd 0.635 x 1.27: 1 -0.406,0; 2 0.406,0
2X5-PTH-1.27MM = drill 0.508 pad 1: 1 -2.54,-0.635; 2 -2.54,0.635; 3 -1.27,-0.635; 4 -1.27,0.635; 5 0,-0.635; 6 0,0.635; 7 1.27,-0.635; 8 1.27,0.635; 9 2.54,-0.635; 10 2.54,0.635
0603 = smd 1.1 x 1: 1 -0.85,0; 2 0.85,0
LED3535 = smd 1 x 0.85: 1 -1.75,0.875; 2 -1.75,-0.875; 3 1.75,-0.875; 4 1.75,0.875
LED-0603 = smd 0.8 x 0.8: A 0,-0.75; C 0,0.75
PTSM_M2_SMD = smd 2.2 x 5.6: NC0 -4.325,-3.55; NC2 4.325,-3.55 | smd 1.2 x 3.2: P1 -1.31,0.8; P2 1.25,0.8
SOT23 = smd 1 x 1.4: 1 -0.95,-1.1; 2 0.95,-1.1; 3 0,1.1
SOT23-3 = smd 0.8 x 0.9: 1 -0.95,-1; 2 0.95,-1; 3 0,1.1
0603-RES = smd 1.1 x 1: 1 -0.85,0; 2 0.85,0
0603-RES@1 = smd 1.1 x 1: 1 -0.85,0; 2 0.85,0
R0805 = smd 1.1 x 1.4: 1 -1,0; 2 1,0
TACTILE_SWITCH_SMD_4.6X2.8MM = smd 0.9 x 1: 1 -2.05,-0.8; 2 2.05,-0.8; 3 2.05,0.8; 4 -2.05,0.8
SDP5XX_6XX = drill 0.85 square: P1 -3,-2.75 | drill 0.75: P2 -1,-2.75; P$3 1,-2.75; P$4 3,-2.75 | hole 3: -12,0; 12,0 | hole 2: -11.1,4.45; 11.1,5.95; 11.1,-5.8; -11.125,-5.8 | hole 0.75: -11.3,-3 | hole 0.85: 11.3,3
PAD.03X.03 = smd 0.762 x 0.762: P$1 0,0
TQFP-48 = smd 1.5 x 0.28: 1 -4.25,2.75; 2 -4.25,2.25; 3 -4.25,1.75; 4 -4.25,1.25; 5 -4.25,0.75; 6 -4.25,0.25; 7 -4.25,-0.25; 8 -4.25,-0.75; 9 -4.25,-1.25; 10 -4.25,-1.75; 11 -4.25,-2.25; 12 -4.25,-2.75; 25 4.25,-2.75; 26 4.25,-2.25; 27 4.25,-1.75; 28 4.25,-1.25; 29 4.25,-0.75; 30 4.25,-0.25; 31 4.25,0.25; 32 4.25,0.75; 33 4.25,1.25; 34 4.25,1.75; 35 4.25,2.25; 36 4.25,2.75 | smd 0.28 x 1.5: 13 -2.75,-4.25; 14 -2.25,-4.25; 15 -1.75,-4.25; 16 -1.25,-4.25; 17 -0.75,-4.25; 18 -0.25,-4.25; 19 0.25,-4.25; 20 0.75,-4.25; 21 1.25,-4.25; 22 1.75,-4.25; 23 2.25,-4.25; 24 2.75,-4.25; 37 2.75,4.25; 38 2.25,4.25; 39 1.75,4.25; 40 1.25,4.25; 41 0.75,4.25; 42 0.25,4.25; 43 -0.25,4.25; 44 -0.75,4.25; 45 -1.25,4.25; 46 -1.75,4.25; 47 -2.25,4.25; 48 -2.75,4.25
SOT23-5 = smd 0.55 x 1.2: 1 -0.95,-1.3; 2 0,-1.3; 3 0.95,-1.3; 4 0.95,1.3; 5 -0.95,1.3
SOIC8_208MIL = smd 0.6 x 2.2: 1 -1.905,-3.315; 2 -0.635,-3.315; 3 0.635,-3.315; 4 1.905,-3.315; 5 1.905,3.315; 6 0.635,3.315; 7 -0.635,3.315; 8 -1.905,3.315
DLC-L01G-U2 = smd 0.991 x 1.524: 1 -2.54,5.08; 2 0,5.08; 3 2.54,5.08; 4 2.54,-5.08; 5 0,-5.08; 6 -2.54,-5.08
PTSM_M6_THRHOLE = drill 1 octagon: P1 6.25,1 | drill 1: P2 3.75,1; P3 1.25,1; P4 -1.25,1; P5 -3.75,1; P6 -6.25,1
PTSM_M2_THRHOLE = drill 0.8: 1 1,1; 2 3.5,1
PTSM_M5_THR_UP = drill 0.8 octagon: P1 11,2.5 | drill 0.8: P2 8.5,2.5; P3 6,2.5; P4 3.5,2.5; P5 1,2.5
PTSM_M6_TH_UP_NEUTRAL = drill 1 octagon: P1 6.25,0 | drill 1: P2 3.75,0; P3 1.25,0; P4 -1.25,0; P5 -3.75,0; P6 -6.25,0
CRYSTAL-SMD-3.2X1.5MM = smd 1 x 1.8: P$1 -1.25,0; P$2 1.25,0

### Placement (x,y rotation side)
798-ZX62-B-5PA11  4.75,33.95 270 top
C1  15,44 0 top
C2  79,8 270 top
C3  65,37 0 top
C4  11,16.7 180 top
C6  20.52,6.05 180 top
C8  17,25.16 0 top
C9  26.2,32.2 270 top
C11  8.65,28.76 180 top
C12  22.68,26.53 0 top
C13  22.7,31.6 180 top
C14  29,37 0 top
C15  41,37 0 top
C16  53,37 0 top
F2  7.07,41.47 0 top
FD1  3,7 0 top
FD2  78,48 0 top
HALLSENSOR  43.7,12 0 top
IC1  19,13 0 top
JP1  16,47 0 top
JP2  31,13 270 bottom
JP3  67,5 270 top
JP4  11,39 180 top
JP5  15.89,21.64 0 top
JP6  69,7 90 bottom
JP7  69,11 270 bottom
JP8  12,41.5 180 bottom
JP9  56,32 0 bottom
JP10  56,29 0 bottom
L1  19.93,25.49 90 top
LED1  80,35 0 top
LED2  80,15 0 top
LED4_3.3V  5.4,20 90 top
LED4_3.3V1  5.4,18 90 top
LED4_3.3V2  5.4,24 90 top
LED4_3.3V3  5.4,22 90 top
POWER_5.0V1  61,40 0 top
POWER_5.0V2  25,40 0 top
POWER_5.0V3  37,40 0 top
POWER_5.0V4  49,40 0 top
POWER_5.0V5  5.4,26 90 top
PUMP  65,42 180 top
Q1  28,15 0 top
Q2  11.33,41.5 90 top
Q3  33,15 0 top
R1  9,22 180 top
R2  9,20 180 top
R4  15.15,38.61 180 top
R5  31,28 0 top
R6  5,28.39 180 top
R7  14.2,41.4 90 top
R8  21.97,23.5 90 top
R9  31,30 0 top
R13  61,37 90 top
R14  25,37 90 top
R15  37,37 90 top
R16  49,37 90 top
R17  9,26 180 top
R18  31,32 0 top
R19  31,34 0 top
R20  31,24 0 top
R21  31,26 0 top
R22  33,19 90 top
R23  28,19 270 top
R24  28,12 0 top
R26  33,12 180 top
R27  9,24 180 top
R28  9,18 180 top
S1  10,46.5 0 top
SDP5XX6XX1  51,26 0 top
TP1  73,43 0 bottom
TP2  76,43 0 bottom
U1  15.31,32.34 180 top
U2  9.86,13.49 180 top
U3  17.7,41.4 270 top
U4  73,5 90 top
U$1  73,35 0 top
U$2  57,8 180 top
U$3  29,8 180 top
U$4  73,15 0 top
U$5  39,8 180 top
U$6  18,7 180 top
U$9  57,12 0 top
VALVE_A  29,42 180 top
VALVE_B  41,42 180 top
VALVE_C  53,42 180 top
Y1  22.7,29.13 270 top

### Tracks (layer width: path | path; a pad name or v marks a point on that pad's centre or on a via)
3.3V  (via drill 0.3, 0.35)
  Top 0.254: LED1.2 78.18,34.06 76.69,34.06 73,30.37 U$1.5 73,29.79 73,24.31 77.42,19.89 77.42,15.09 78.26,14.25 LED2.2 78.26,14.1 78.26,10.97 | 78.26,10.97 78.26,9.75 78.94,9.07 C2.1 | 78.26,10.97 74.91,10.97 73.91,9.98 73.08,9.98 U$4.5 72.92,9.83 72.92,4.89 71.16,3.12 69.8,3.12 U4.8 69.59,3 v65,3 | 11.43,12.8 11.43,15.47 11.51,15.54 11.51,16.61 C4.1 11.73,17.07 12.27,17.6 12.27,19.58 | 11.43,12.8 U2.5 | R2.1 9.91,19.96 10.52,19.96 10.59,19.89 10.97,19.89 11.28,19.58 12.27,19.58 | 10.47,28.98 11.05,29.57 U1.36 | 10.47,28.98 10.29,28.8 9.3,28.8 C11.1 | R8.2 21.95,24.38 21.72,24.61 19.96,24.61 L1.1 19.89,24.54 19.89,21.34 18.75,20.19 14.17,20.19 13.41,20.95 JP5.1 13.34,21.03 12.5,21.87 12.5,23.46 12.26,23.69 | R17.1 9.96,26 12.26,23.69 | v15.09,25.15 16.08,25.15 C8.1 | 12.26,23.69 14.86,26.29 15.39,26.29 16,26.9 16,28.04 U1.44 | v14.4,31.09 16,32.69 16,36.58 U1.17 | v9.83,29.62 10.47,28.98 | R19.2 31.85,33.98 31.85,32.08 R18.2 31.85,31.93 31.85,30.1 R9.2 31.85,29.95 31.85,28.04 R5.2 31.85,27.89 31.85,26.06 R21.2 31.85,25.98 R20.2 31.93,23.93 v32.92,23.93 | Q1.1 27.05,13.87 27.05,12.04 R24.1 27.13,11.96 27.36,11.96 28.35,10.97 30.94,10.97 31.93,11.96 R26.2 | R26.2 32,12.04 32,13.87 Q3.1 | R26.2 32.08,11.96 32.38,11.96 33.38,10.97 40.23,10.97 41.15,11.89 HALLSENSOR.P3 | U$6.P3 12.98,5.48 v13.25,5.48 | v12,12 11.43,12.57 11.43,12.8 | 12.27,19.58 12.42,19.58 v12.65,19.81 | U$2.P3 57,5.75 57,4 v58,3 | v65,5 65.41,5.41 JP3.1
  Bottom 0.254: v15.09,25.15 12.5,22.55 12.5,21.87 13.34,21.03 JP5.1 13.34,20.88 12.65,20.19 v12.65,19.81 | v15.09,25.15 14.4,25.83 v14.4,31.09 12.5,32.99 12.04,32.99 9.83,30.79 v9.83,29.62 | 43.05,13.79 41.22,11.96 HALLSENSOR.P3 41.15,11.89 37.8,8.53 37.8,7.01 U$5.P3 | 43.05,13.79 44.81,15.54 | 44.81,15.54 49.99,20.73 49.99,23.24 SDP5XX6XX1.P2 | 43.05,13.79 v32.92,23.93 31.77,25.07 15.16,25.07 v15.09,25.15 | 44.81,15.54 49.45,10.9 50.83,10.9 54.71,7.01 55.7,7.01 U$2.P3 | v12,12 12,11.16 12.51,10.65 12.51,6.22 v13.25,5.48 | v58,3 64,3 | 64,3 v65,3 | 64,3 64,4 v65,5
5V  (via drill 0.3, 0.35)
  Top 0.254: v22.89,48.11 21.79,47.02 16.46,47.02 JP1.2 | U$9.P2 60.73,12.04 50.95,21.82 50.95,38.51 49.45,40.01 v46.01,40.01 v46,40 | v45.64,15.54 44.65,15.54 43.51,16.69 36.35,16.69 33.07,19.96 R22.2 32.92,19.96 v31.77,19.96 | v30.71,19.96 28.04,19.96 R23.1
  Bottom 0.254: v46,40 38,48 23,48 v22.89,48.11 | 61.49,12.72 58.67,15.54 v45.64,15.54 | 61.49,12.72 61.8,12.42 61.8,11.96 62.87,10.9 63.09,10.9 66.45,7.54 68.89,7.54 JP6.2 | v31.77,19.96 v30.71,19.96 | 61.49,12.72 60.81,12.04 U$9.P2
!RESET  (via drill 0.35)
  Top 0.152: S1.3 12.04,47.32 8,47.32 S1.4 5.56,44.91 5.56,44.77 4,43.21 v4,43 | 19.32,25.41 18.97,25.07 18.97,22.86 18.44,22.33 JP5.10 | 19.32,25.41 19.36,25.45 22.25,25.45 22.71,24.99 22.71,23.7 22.02,23.01 22.02,22.71 R8.1 21.95,22.63 19.16,19.84 18.97,19.84 18.91,19.79 16.79,19.79 v16,19 | 19.32,25.41 19.13,25.6 19.13,28.73 17.68,30.17 15.23,30.17 14.1,29.03 14.1,28.12 U1.40 | v2.9,24.61 4.88,22.63 5.18,22.63 5.49,22.33 5.49,21.49 5.54,21.49 5.66,21.37 6.64,21.37 6.76,21.49 7.29,21.49 7.5,21.27 10.43,21.27 10.6,21.1 12.2,21.1 14,19.3 v14,19
  Bottom 0.152: v14,19 v16,19 | v4,43 2.3,41.3 2.3,25.21 v2.9,24.61
A1  (via drill 0.3)
  Top 0.152: v41.99,13.56 43.66,11.89 HALLSENSOR.P2 | U1.7 19.58,32.61 23.47,32.61 24.77,31.32 24.77,24.15 25.49,23.42 25.49,21.61 v24.77,20.88
  Bottom 0.152: v24.77,20.88 30.56,15.09 31.52,15.09 33.55,13.06 37.06,13.06 37.94,13.94 41.61,13.94 v41.99,13.56
D3_SCL_PA09  (via drill 0.3, 0.35)
  Top 0.152: v73,41.68 U$1.2 73.3,39.78 v73.3,38.9 | v31.09,31.01 30.18,31.93 R18.1 | v18.29,35.13 17.6,35.81 17.6,36.58 U1.14
  Top 0.254: v59,31 61.1,31 61.53,30.57 62.43,30.57 v63.62,29.38
  Bottom 0.152: v73,41.68 73,42.98 TP1.P$1 | v18.29,35.13 21.87,35.13 28.5,28.5 29.34,28.5 31.09,30.25 v31.09,31.01 37.41,31.01 45.11,23.32 47.93,23.32 SDP5XX6XX1.P1 48.01,23.32 48.84,24.16 50.37,24.16 50.9,23.62 50.9,23.09 51.66,22.33 54.86,22.33 60.12,27.58 62,27.58 62,27.62 62.25,27.88 63.12,27.88 63.12,28.88 v63.62,29.38 73.12,38.88 73.28,38.88 v73.3,38.9
  Bottom 0.254: JP9.1 58,32 v59,31
D4_SDA_PA08  (via drill 0.3)
  Top 0.152: v75.59,41.91 75.59,40.08 U$1.3 | v31.17,32.99 30.18,33.98 R19.1 | U1.13 18.2,36.45 20.1,36.45 v20.3,36.65
  Bottom 0.152: TP2.P$1 75.97,42.98 75.97,42.29 v75.59,41.91 73.99,41.91 58.52,26.44 | v20.3,36.65 29.11,36.65 31.17,34.59 v31.17,32.99 44.27,32.99 53.95,23.32 SDP5XX6XX1.P$4 54.03,23.32 55.4,23.32 58.52,26.44 | 58.52,26.44 58.37,26.59 58.31,26.69
  Bottom 0.254: JP10.1 57.69,28.12 57.69,27.05 58.05,26.69 58.31,26.69
D11_SDA_PA16  (via drill 0.3)
  Top 0.152: 70.45,7.66 69.72,6.93 U4.5 | 70.45,7.66 71.25,8.46 71.25,9.75 75.51,14.02 75.51,20.04 U$4.3 | v28.57,26.82 28.42,26.67 28.42,25.83 30.1,24.16 30.1,24 R20.1 30.02,24 29.95,24 26.21,20.27 26.21,11.2 v26.59,10.82 | v13.11,34.52 12.57,35.05 11.12,35.05 U1.25 | v70.41,7.7 70.45,7.66
  Bottom 0.152: v28.57,26.82 20.8,26.82 v13.11,34.52 | v70.41,7.7 70.41,6.71 69.27,5.56 31.85,5.56 v26.59,10.82
D12  (via drill 0.3)
  Top 0.152: v9.91,18.9 9.91,18.06 R28.1 | v12.42,30.25 12.42,31.01 12.8,31.39 12.8,32.61 11.89,33.53 11.12,33.53 U1.28
  Bottom 0.152: v9.91,18.9 10.31,19.3 10.31,28.14 v12.42,30.25
D13_SCL_PA17  (via drill 0.3)
  Top 0.152: 68.39,6.44 69.19,5.64 69.65,5.64 U4.6 | 68.39,6.44 68.35,6.48 68.35,9.45 73,14.1 73,20.04 U$4.2 | v28.96,26.06 30.1,26.06 R21.1 30.18,25.98 30.94,25.22 30.94,23.39 30.79,23.24 29.64,23.24 26.52,20.12 26.52,18.36 v26.82,18.06 | v12.34,34.52 11.12,34.52 U1.26 | v37.11,9.07 38.89,7.29 38.89,5.81 41.06,3.64 45.79,3.64 50.35,8.2 55.96,8.2 56.77,7.39 56.77,7.09 57.91,5.94 63.63,5.94 64.08,6.4 68.35,6.4 68.39,6.44
  Bottom 0.152: v28.96,26.06 20.8,26.06 v12.34,34.52 | v37.11,9.07 31.39,14.78 30.1,14.78 v26.82,18.06
D14_HB  (via drill 0.35)
  Top 0.152: U1.3 19.51,30.56 13.79,30.56 12.12,28.88 12.09,28.88 v11.62,28.41 | R27.1 11.01,24 v11.3,23.71
  Bottom 0.152: v11.3,23.71 11.3,26.39 11.96,27.04 12.03,27.04 12.36,27.37 12.36,27.83 12.03,28.16 11.87,28.16 v11.62,28.41
EOC_A_D16  (via drill 0.3)
  Top 0.152: v18.29,32.54 18.82,33.07 19.51,33.07 U1.8 | v20.73,27.66 20.73,26.66 21.64,25.76 22.63,25.76 23.93,24.46 23.93,23.77 22.71,22.55 22.71,21.95 21.95,21.18 20.95,21.18 18.59,18.82 16.84,18.82 15.16,17.14 v15.16,11.89 | v74.52,9.37 74.98,9.37 75.51,9.91 U$4.4
  Bottom 0.152: v18.29,32.54 18.29,29.87 20.5,27.66 v20.73,27.66 | v15.16,11.89 21.18,5.87 31.01,5.87 34.99,1.89 66.05,1.89 71.32,7.16 71.32,9.07 71.63,9.37 v74.52,9.37
EOC_B_D17  (via drill 0.3, 0.35)
  Top 0.152: v23.55,35.59 21.49,33.53 19.58,33.53 U1.9 | v75.12,35.36 74.72,35.36 71.64,38.44 71.64,41.13 71.19,41.57 69.07,41.57 67.13,43.51 65.46,43.51 65.15,43.2 63.17,43.2 62.48,42.52 56.08,42.52 55.55,43.05 50.6,43.05 50.06,42.52 48.08,42.52 46.94,41.38 45.26,41.38 43.59,43.05 39.01,43.05 38.48,42.52 32.08,42.52 31.55,43.05 27.05,43.05 26.52,42.52 25.6,42.52 24.31,41.22 24.31,40.31 24.54,40.08 25.3,40.08 25.68,39.7 25.68,39 26.34,38.34 26.34,38.27 27.31,37.3 27.4,37.3 27.47,37.23 27.47,36.3 27.61,36.17 27.65,36.17 v28,35.82 | U$1.4 75.54,31.44 v75.8,31.7
  Bottom 0.152: v23.55,35.59 27.77,35.59 v28,35.82 | v75.8,31.7 75.8,33.11 75.34,33.57 75.34,35.14 v75.12,35.36
GND  (via drill 0.35)
  Top 0.254: 11.36,18 11.28,17.91 10.42,17.05 C4.2 | U1.35 10.19,30.09 10.07,30.21 9.59,30.21 9.38,30 9,30 7.2,31.8 v7.2,32.2 | U1.5 20.47,31.59 20.56,31.5 21.05,31.5 21.15,31.6 C13.2
  other vias: 80.4,21.4 53,32 52,31 52,30 52,32 54.4,34.8 52,33 50,32 49,32 48,31 50,31 50,29 8.2,16.6 9.9,13.4 9.9,10.4 11.9,10.4 10.9,10.4 15.2,8.5 13.2,7.5 14.7,6.9 15.7,6.9 16.7,6.9 19.2,6.9 19.2,3.9 20.2,3.9 22.2,3.9 21.2,3.9 23.2,3.9 22.8,5.3 23.8,5.3 24.8,5.3 25.8,5.3 24.8,9.3 24.8,10.3 26.8,8.3 29.8,9.3 30.8,9.3 31.8,9.3 30.8,4.3 30.8,3.3 8.9,10.4 7.9,8.4 8.9,7.4 10.9,8.4 11.9,8.4 13.2,8.5 13.2,9.5 13.2,11.5 13.2,10.5 13,14 13,18.4 15,18 14,18 20.8,23.6 20.8,22.6 17.8,23.6 12.1,26.1 12.2,25.2 11,22.9 3,18.9 3,20.9 3,22.9 3,15.9 3,16.9 11.8,27.6 6.8,30 6.8,27 3.6,25.8 1.6,25.8 1.6,26.8 1.6,27.8 5.7,35.3 6.7,36.3 7.7,37.3 8.7,38.3 8.7,39.3 6.7,39.3 4.7,39.3 6.7,43.3 2.7,44.3 1.7,43.3 1.7,42.3 1.7,41.3 19.7,46.3 19.7,48.3 18.7,48.3 18.7,46.3 20.7,46.3 27.7,47.3 28.7,47.3 29.7,47.3 27.7,49.4 28.7,49.4 29.7,49.4 35.7,49.4 36.7,49.4 37.7,49.4 39.7,48.4 38.7,46.4 39.7,45.4 40.7,47.4 41.7,46.4 40.7,44.4 38.7,38.4 38.7,37.4 40.7,34.4 41.7,34.4 42.7,34.4 43.7,34.4 43.7,38.4 43.7,37.4 47.7,38.4 47.7,37.4 47.7,34.4 46.7,34.4 44.7,30.4 45.7,32.4 43.7,30.4 43.7,29.4 39.3,28.2 42.1,24.9 44.1,26.9 44.1,25.9 43.1,23.9 41.1,23.9 38.1,23.9 37.1,23.9 37.1,24.9 36.1,24.9 35.1,27.9 35.1,26.9 35.1,25.9 32.8,26.9 32.8,28.9 34.8,31.9 35.8,31.9 36.8,31.9 36.8,29.9 35.8,29.9 34.8,29.9 34.8,33.9 35.8,33.9 36.8,33.9 33.8,34.9 31.9,35.5 32.9,35.5 34.9,35.5 34.9,37.5 33.9,37.5 32.9,37.5 31.9,37.5 28.9,38.5 26.9,38.5 22.9,37.5 23.9,39.5 20.9,39.5 20.9,41.5 15.2,41 15,44 17,44 18,44 18,46 14,47 11,44 10,43 10,44 5,45 4,15 4,13 8,15 8,14.1 8,11 7.7,6.8 8.3,5.4 5.7,4.8 4.7,5.8 4.7,6.8 4.7,7.8 10.6,3.6 10.6,1.6 12.6,1.6 11.6,1.6 9.6,1.6 8.6,2.6 16.6,1.6 17.6,1.6 18.6,1.6 13,3.9 21,1.9 22,1.9 23,1.9 29,2.9 27,3.9 28.1,5.3 30.1,4.3 34.2,8.5 36.2,8.5 37.2,4.5 39.2,3.5 39.2,4.5 34.2,3.5 34.2,4.5 40.2,8.5 41.2,9.5 43.2,9.5 44,6.6 45.2,9.5 39.3,11.7 38.2,11.7 36.8,11.7 35.8,11.7 35.2,14.5 36.8,13.7 38.2,14.5 39.2,14.5 39.8,15.8 38.8,15.8 37.8,15.8 36.8,15.8 35.8,15.8 31.8,17 29.2,17.4 28,14.8 25.3,15.9 25.3,12.9 25.3,16.9 25.3,17.9 30,18 29.8,18.8 29.6,20.8 28.6,23.8 26.6,23.8 23.3,24.3 24.4,23.45 32.9,31.9 32.9,29.9 32.9,33.6 30,33 30,31 27.7,30.7 26.2,29.1 27.2,27.6 25.5,30.6 24,29.1 21,28.4 26.7,33.7 24.7,33.7 25.7,33.7 23.7,34.7 21.2,34.1 17.2,34.1 17.2,32.1 15.2,34.1 15.2,35.1 17.7,39.5 19.4,38.6 19.3,37.1 13.53,31.1 13.6,29.5 9.3,27.4 9.3,25 11.52,20.2 11.6,18 9,29.7 13.6,26.1 15.1,23.9 17.8,26.5 15.1,26.9 15.92,29.6 34.8,19.8 35.8,18.8 36.8,17.8 41.8,18.8 42.8,18.8 43.8,18.8 43.8,19.8 43.8,20.8 45.8,20.8 45.8,19.8 45.8,18.8 47.8,19.8 48.8,20.8 50.8,19.8 49.8,18.8 48.8,17.8 50.8,17.8 52.8,17.8 51.8,18.8 48.8,14.8 49.8,14.8 50.8,14.8 51.4,16.4 50.4,16.4 49.4,16.4 48.4,16.4 47.4,16.4 49.3,12.3 47.7,11.5 52.5,14 57.5,14 54.5,14 53.5,14 61.5,14 61.5,15 61.5,16 61.5,17 63.5,17 63.5,16 63.5,15 57.1,9.5 59.1,9.5 58.1,9.5 54.1,9.5 51.1,9.5 50.1,9.5 59.5,7.8 65.3,7.8 65.3,9.8 71.9,7.8 71.9,6.8 71.9,2.8 69.9,1.8 66.9,1.8 67.9,1.8 68.9,1.8 73.9,3.8 73.9,4.8 73.9,5.8 74.9,11.8 76.9,11.8 79.9,11.8 76.9,13.8 73.9,13.8 71.9,11.8 70.9,14.8 68.9,12.8 73.9,17.8 76.9,22.8 73.9,27.8 71.9,27.8 76.9,34.8 79.9,34.8 76.9,31.8 80.9,30.8 70.9,37.8 67.9,34.8 65.9,32.8 63.9,30.8 65.9,28.8 68.9,28.8 68.9,29.8 68.9,30.8 68.9,31.8 68.9,32.8 67.9,38.8 67.9,39.8 67.9,40.8 64.9,38.8 64.9,39.8 64.9,40.8 64.9,43.8 64.9,34.8 62.9,34.8 62.9,36.8 62.9,37.8 61.9,39.8 57.9,39.8 57.9,35.8 38.6,41.6 35.6,41.6 41,41.2 41,39.2 41,35.2 35,39.2 35,40.2 9.8,36.4 8.6,35.3 9.9,40 13.3,46.2 15.4,45.6 13.4,48.6 39,22 34.3,17 31.8,17.8 49.6,6.2 45.2,4.9 42.2,4.9 43.2,4.9 44.2,4.9 44.2,2.9 46.2,2.9 47.2,3.9 48,8.6 47,7.7 21,30.9 22.4,29.2 24.1,30.8 61.3,28.3 60.3,29.3 59.3,29.3 59.3,28.3 58.3,28.3 58.3,27.3 60.3,26.3 59.3,25.3 60.3,25.3 66.3,30.3 63.9,33.8 63.9,34.8 67.9,37.8 68.9,35.8 69.9,36.8 71.8,34.9 71.9,35.8 70.9,34.8 75.9,34.2 74.5,33.2 73.1,32.1 78.9,37.8 50.4,40 50.4,42 53,41.3 53,40.3 53,39.3 46.4,42 44.4,40 47.4,41 3.7,41.3 3.7,40.3 2.9,28.5 2.9,27.5 6.1,33 7.5,34.5 3.5,39.5 1.5,40.5 9.5,46.5 10.5,48.5 5.5,46.5 6.5,44.5 58.3,24.3 57.3,23.3 56.3,22.3 55.3,21.3 54.3,21.3 53.3,21.3 55.3,20.3 71.9,5.8 71.9,4.8 71.9,8.8 73.9,8.8 69.2,8.9 67.2,8.9 76.9,9.8 22,6.9 21.5,8.5 21.7,18.3 26.4,22.2 30.4,22.2 24.4,22.2 36.4,23.2 33.4,26.2 28.6,27.7 29.4,27 11.1,37.8 18,14 21,14 15.8,13.57 15.7,4.7 29.5,6.8 37,20.8 40,17.9 41.7,16.05 37.8,20 34.8,23 33.8,22.1 40.2,14.5 45.2,13.5 47.2,14.5 38.3,13.3 39.3,13.3 26,37.6 25.9,41.9 22.1,40.5 29,42.2 26.5,43.6 29,43.9 31.5,42 24,42.1 26.4,40.1 35,43.4 31.3,43.9 59,43.3 47,49 59,48.9 56,41.9 57,41.9 58,41.9 61,41.9 50.4,44 51.4,44 53.4,44 55.4,44 54.4,44 55.4,38 56.4,36 55.4,36 62.5,41.7 62.5,43.7 70.9,42.3 67,44.5 74.4,41.2 51.4,39.1 50.1,38.3 50.1,35.4 31.6,15.7 25.8,10.3 72.2,38.9 73.8,37.8 76.6,19.3 73.4,22.4 74,25.1 65.3,4 13.3,16.1 8,12.1 4.6,14 2.6,14 6.8,25 10.9,27.4 53,29 52,28 55.7,27.6 54.3,25.8 57.3,26.2 53.8,28.1 53,25.2 55.2,24.3 56.2,25.7 57,27.3 49.4,26.9 52.6,35.1 55.4,34.8 56.1,33.3 57.9,31.2 58.9,0.8 54.9,0.8 53.9,2.8 51.9,2.8 45.9,0.8 41.9,0.8 31.9,1.8 31.9,2.8 38.9,0.8 39.9,0.8 61.9,4.8 66.6,3.7 65.4,1 62.9,3.8 60.9,3.8 59.9,4.8 55.9,4.8 55.9,3.8
  pour Bottom: -2.63,51.67 87.5,51.88 87.5,-2.53 -2.63,-2.53
  pour Top: 96.5,61.68 96.5,-4.53 -3.63,-4.53 -3.63,61.68
HEAT
  Bottom 0.254: JP6.1 68.96,6.63 65.15,6.63 60.88,10.9 51.89,10.9 50.83,11.96 U$9.P6
HEAT_GND
  Bottom 0.254: JP7.1 68.96,11.43 63.86,11.43 63.32,11.96 U$9.P1
INT
  Top 0.152: U$2.P6 61.44,8.81 49.35,8.81 47.55,7.01 45.26,7.01 U$5.P6
N$1
  Top 0.152: LED4_3.3V2.A 6.17,24 8.08,24 R27.2
N$2
  Top 0.152: LED4_3.3V1.A 6.17,17.98 8.08,17.98 R28.2
N$3
  Top 0.152: LED4_3.3V3.A 6.17,22.02 8.08,22.02 R1.2
N$8
  Top 0.152: C12.2 23.24,26.59 23.24,27.28 22.71,27.81 Y1.P$2 22.63,27.89 20.95,29.57 19.58,29.57 U1.1
N$9
  Top 0.152: 798-ZX62-B-5PA11.1 4.12,35.28 4.42,35.28 5.64,36.5 5.64,41.45 F2.1
N$11  (via drill 0.3)
  Top 0.152: v5.03,27.51 4.19,28.35 R6.2 | v5.18,32.23 5.18,32.77 4.72,33.22 4.12,33.22 798-ZX62-B-5PA11.4 | U3.1 16.46,42.29 16.46,41.45 U3.2 16.46,41.38 16.54,41.3 19.36,41.3 19.89,40.77 19.89,40.08 18.44,38.63 16,38.63 R4.1 15.93,38.63 15.16,39.4 v12.34,39.4
  Bottom 0.152: v5.18,32.23 5.03,32.08 v5.03,27.51 5.03,27.05 4.34,26.36 3.89,26.36 3.58,26.67 3.58,32.16 10.82,39.4 v12.34,39.4
N$12
  Top 0.152: Q2.1 12.34,40.54 14.17,40.54 R7.1 14.25,40.54 14.86,39.93 17.14,39.93 17.6,40.39 18.97,40.39 U3.4
N$13
  Top 0.152: C13.1 23.24,31.55 23.24,30.94 22.71,30.4 Y1.P$1 22.63,30.33 22.4,30.1 19.58,30.1 U1.2
N$24
  Top 0.152: POWER_5.0V1.A 61.04,39.24 61.04,37.87 R13.2
N$25
  Top 0.152: POWER_5.0V2.A 24.99,37.87 R14.2
N$26
  Top 0.152: LED1.3 78.26,30.63 78.26,15.93 LED2.1
N$27
  Top 0.152: POWER_5.0V3.A 37.03,39.24 37.03,37.87 R15.2
N$28
  Top 0.152: POWER_5.0V4.A 49,37.87 R16.2
N$29
  Top 0.152: POWER_5.0V5.A 6.17,25.98 8.08,25.98 R17.2
N$33
  Top 0.152: LED4_3.3V.A 6.17,20.04 8.08,20.04 R2.2
PROG_LED_D2  (via drill 0.3)
  Top 0.152: v4.12,26.9 4.65,26.36 4.65,26.06 POWER_5.0V5.C | 13.03,37.34 13.03,36.65 U1.23 13.03,37.34 | v9.83,37.34 10.06,37.11 11.36,37.11 12.04,37.8 12.57,37.8 13.03,37.34
  Bottom 0.152: v4.12,26.9 4.12,32.23 9.3,37.41 9.83,37.41 v9.83,37.34
PUMP_D6
  Top 0.152: U1.29 11.05,33.15 10.29,33.15 9.3,34.14 9.3,36.04 9.22,36.12 9.22,38.03 9.34,38.16 9.34,40.23 9.67,40.56 10.39,40.56 10.68,40.84 11.65,40.84 11.65,41.05 11.79,41.18 13.46,41.18 13.61,41.33 14.74,41.33 15.57,42.16 15.57,42.72 15.71,42.85 15.95,42.85 16,42.9 17.22,42.9 18.52,41.6 19.81,41.6 24.46,36.96 25.6,36.96 26,36.56 26,36.07 28.27,33.8 28.27,30.34 25.83,27.9 25.83,21.18 22.02,17.37 20.5,17.37 20.27,17.14 20.27,15.01 18.06,12.8 16.84,12.8 14.63,10.59 14.63,9.98 IC1.1
PUMP_GND
  Top 0.254: POWER_5.0V1.C 61.04,40.77 63.32,40.77 63.7,41.15 PUMP.P2 | C3.1 64.08,37.03 64.08,40.01 63.4,40.69 PUMP.P2 | IC1.16 14.55,16 14.55,11.73 13.95,11.12 13.95,8.76 14.94,7.77 24.92,7.77 27.66,10.52 60.73,10.52 62.18,11.96 62.18,18.29 67.21,23.32 67.21,42.9 66.98,43.13 65.61,43.13 63.78,41.3 PUMP.P2
SCL_5V
  Top 0.152: Q3.3 32.99,16.15 32.99,17.98 R22.1 32.92,17.98 31.24,19.66 31.24,20.19 31.85,20.8 35.14,20.8 38.87,17.07 53.19,17.07 58.22,12.04 U$9.P3
SCL_PA23  (via drill 0.3)
  Top 0.152: v12.27,31.62 11.12,31.62 U1.32 | v8.69,23.01 7.09,23.01 v6.86,22.78 | v31.09,29.03 30.18,29.95 R9.1 | v43.2,13.11 v43.2,15.54 | v55.17,30.86 55.17,28.5 v51.59,24.92 | v40.62,18.52 v47.02,24.92 | v55.32,9.91 54.48,9.91 54.33,10.06 42.29,10.06 v42.14,9.91 | U$6.P4 14.55,4.5 15.09,4.5 16.31,3.28 27.58,3.28 33.91,9.6 37.64,9.6 40.23,7.01 U$5.P4
  Bottom 0.152: v12.27,31.62 12.27,31.17 8.69,27.58 v8.69,23.01 | v6.86,22.78 6.86,11.05 13.34,4.57 14.48,4.57 U$6.P4 | v31.09,29.03 31.09,27.51 38.48,20.12 38.48,19.66 39.62,18.52 40.23,18.52 40.42,18.33 | v43.2,15.54 40.42,18.33 | v43.2,13.11 43.2,12.72 42.14,11.66 v42.14,9.91 42.14,8.84 40.31,7.01 U$5.P4 | v55.17,30.86 55.17,31.93 JP9.3 | v47.02,24.92 v51.59,24.92 | 40.42,18.33 v40.62,18.52 | v55.32,9.91 58.22,7.01 U$2.P4
SCL_SFM  (via drill 0.3)
  Top 0.152: v50.37,27.66 50.37,24.84 49.07,23.55 49.07,22.33 56.92,14.48 56.92,13.79 57.68,13.03 58.67,13.03 59.28,12.42 59.28,11.58 58.6,10.9 43.51,10.9 42.14,12.27 42.14,12.34 41.6,12.88 39.7,12.88 39.09,12.27 34.29,12.27 34.06,12.04 R26.1 34.21,12.27 33.98,12.5 33.98,13.87 Q3.2
  Bottom 0.152: v50.37,27.66 50.52,27.66 52.73,29.87 54.94,29.87 55.93,30.86 55.93,31.93 JP9.2
SDA_5V
  Top 0.152: R23.2 28.04,17.98 28.04,16.15 Q1.3 28.55,16.65 31.16,16.65 31.47,16.34 32.06,16.34 32.27,16.13 32.27,15.3 32.41,15.17 33.59,15.17 33.63,15.2 41.8,15.2 42.9,16.31 43.36,16.31 46.63,13.03 52.2,13.03 53.19,12.04 U$9.P5
SDA_PA22  (via drill 0.3)
  Top 0.152: U$6.P5 17.07,4.57 28.42,4.57 33.76,9.91 39.85,9.91 U$5.P5 | v29.11,29.03 30.1,28.04 R5.1 | v8.91,33.76 8.91,33.45 9.56,32.8 | 9.56,32.8 10.21,32.16 11.05,32.16 U1.31 | 9.56,32.8 v9.22,32.46
  Bottom 0.152: U$2.P5 60.73,6.93 59.59,6.93 58.6,5.94 52.88,5.94 51.74,7.09 51.74,7.47 51.21,8 47.55,8 47.24,8.31 44.12,8.31 42.82,7.01 U$5.P5 | v29.11,29.03 28.42,29.03 21.34,36.12 19.28,36.12 19.13,36.27 18.67,36.27 | 18.67,36.27 11.43,36.27 v8.91,33.76 | 18.67,36.27 18.67,37.26 19.13,37.72 19.36,37.72 19.74,38.1 23.09,38.1 24.16,37.03 29.18,37.03 31.32,34.9 32.46,34.9 34.06,33.3 49.99,33.3 50.78,34.09 56.74,34.09 59.59,31.24 59.59,30.79 59.21,30.4 56.08,30.4 55.24,29.57 55.24,29.03 JP10.3 | v9.22,32.46 7.39,30.63 7.39,18.36 13.79,11.96 13.79,10.74 17.3,7.24 17.3,6.71 17.07,6.48 17.07,4.57 U$6.P5
SDA_SFM  (via drill 0.3)
  Top 0.152: R24.2 28.96,12.04 28.96,13.87 Q1.2 28.96,13.95 30.56,15.54 v30.56,15.85 | v37.87,33.83 37.87,30.18 36.2,28.5 34.9,28.5 33.98,27.58 33.98,24.23 v30.48,20.73
  Bottom 0.152: v37.87,33.83 40.39,36.35 52.2,36.35 53.11,35.43 55.85,35.43 59.89,31.39 59.89,30.63 59.36,30.1 56.62,30.1 56.01,29.49 56.01,29.03 JP10.2 | v30.48,20.73 30.48,20.5 30.18,20.19 30.18,19.28 30.56,18.9 v30.56,15.85
SWCLK  (via drill 0.35)
  Top 0.152: U1.45 16.61,28.12 16.61,28.88 16.68,28.94 v16.68,29.27 | JP5.4 14.63,22.25 16.99,24.61 v16.99,26.03 v17,26.04
  Bottom 0.152: v17,26.04 16.68,26.36 v16.68,29.27
SWDIO
  Top 0.152: U1.46 16.99,28.04 16.99,27.28 15.62,25.91 15.09,25.91 13.41,24.23 13.41,22.33 JP5.2
USB_D_N
  Top 0.152: 798-ZX62-B-5PA11.2 5.19,34.59 5.36,34.42 6.49,34.42 9.82,31.09 U1.33
USB_D_P
  Top 0.152: 798-ZX62-B-5PA11.3 5.43,33.95 5.59,34.11 6.37,34.11 9.89,30.59 U1.34
USB_HOST_EN
  Top 0.152: R6.1 5.87,28.35 6.78,28.35 8.33,26.8 14,26.8 14.55,27.36 14.55,28.04 U1.41
VALVE_A_D5  (via drill 0.3)
  Top 0.152: v11.66,35.74 12.5,36.58 U1.24 | v16.92,8.38 15.85,9.45 15.85,9.91 IC1.2
  Bottom 0.152: v11.66,35.74 6.22,30.3 6.22,6.58 8.61,4.19 8.61,4.12 9.75,2.97 17.22,2.97 18.21,3.96 18.21,7.09 v16.92,8.38
VALVE_A_GND  (via drill 0.3)
  Top 0.254: POWER_5.0V2.C 25.07,40.77 27.36,40.77 27.74,41.15 VALVE_A.P2 27.43,40.69 28.04,40.08 28.04,37.03 C14.1 28.12,36.88 v28.88,36.12 | v17.52,18.28 15.85,16.61 15.85,16.08 IC1.15 | v25.3,24.46 25.3,29.41 v27.24,31.35
  Bottom 0.254: v17.52,18.28 18.36,18.28 24.54,24.46 v25.3,24.46 | v27.24,31.35 27.54,31.65 27.54,32.64 29.64,34.75 29.64,35.36 v28.88,36.12
VALVE_B_D7  (via drill 0.3)
  Top 0.152: v12.27,32.38 12.12,32.54 11.12,32.54 U1.30 | v17.07,12.27 17.07,9.98 IC1.3
  Bottom 0.152: v12.27,32.38 12.95,31.7 12.95,23.55 12.12,22.71 12.12,19.58 12.19,19.51 12.19,18.08 17.07,13.21 v17.07,12.27
VALVE_B_GND  (via drill 0.3)
  Top 0.254: POWER_5.0V3.C 37.03,40.77 39.32,40.77 39.7,41.15 VALVE_B.P2 39.4,40.69 40.08,40.01 40.08,37.03 C15.1 40.08,36.88 38.48,35.28 38.48,28.19 33.22,22.94 v33.22,22.71 | v21.55,20.64 21.17,20.64 17.14,16.61 17.14,16.08 IC1.14
  Bottom 0.254: v21.55,20.64 23.72,22.81 33.12,22.81 v33.22,22.71
VALVE_C_D9  (via drill 0.3)
  Top 0.152: v18.9,35.74 19.51,35.13 U1.12 | v17.75,8.53 17.75,9.3 18.36,9.91 IC1.4
  Bottom 0.152: v18.9,35.74 12.8,35.74 9.75,32.69 9.75,31.85 7.7,29.79 7.7,18.52 12.8,13.41 12.88,13.41 v17.75,8.53
VALVE_C_GND  (via drill 0.3)
  Top 0.254: POWER_5.0V4.C 49.07,40.77 51.36,40.77 51.74,41.15 VALVE_C.P2 51.44,40.69 52.05,40.08 52.05,37.03 C16.1 52.06,36.99 52.06,35.89 v51.96,35.79 | v23.32,21.57 18.44,16.69 18.44,16.08 IC1.13 | v34.44,21.57 37.19,21.57 39.93,24.31 40.08,24.31 v49.84,34.07
  Bottom 0.254: v51.96,35.79 50.24,34.07 v49.84,34.07 | v23.32,21.57 33.48,21.57 33.55,21.49 34.05,21.49 34.12,21.57 v34.44,21.57
VDDANA  (via drill 0.3)
  Top 0.254: v21.87,33.15 23.47,33.15 23.77,32.84 26.14,32.84 C9.1 | v20.8,32.08 19.58,32.08 U1.6 | v19.96,28.96 19.96,26.36 L1.2
  Bottom 0.254: v21.87,33.15 v20.8,32.08 19.96,31.24 v19.96,28.96
VDDCORE  (via drill 0.3)
  Top 0.254: v20.73,7.16 21.03,6.86 21.03,6.1 C6.1 | v15.16,29.34 15.54,28.96 15.54,28.12 U1.43
  Bottom 0.254: v20.73,7.16 8.08,19.81 8.08,29.64 11.89,33.45 12.88,33.45 15.16,31.17 v15.16,29.34
VIN  (via drill 0.3, 0.35)
  Top 0.254: v13.26,38.86 13.49,38.63 14.25,38.63 R4.2 | 13.26,42.44 14.02,42.44 14.17,42.29 R7.2 14.1,42.52 14.1,43.97 C1.1 | 13.26,42.44 12.34,42.44 Q2.2 | 13.26,42.44 v13.26,43.05 | U2.1 10.74,14.86 10.74,15.24 10.29,15.7 9.45,15.7 8.91,15.16 8.91,14.86 U2.3 8.84,14.71 8.84,14.01 7.01,12.18 7.01,6.09 | 7.01,6.09 7.01,4.57 U$6.P1 | 7.01,6.09 17.87,6.09 18.7,5.26 21.64,5.26 23.32,6.93 25.45,6.93 U$3.2 | U3.5 19.65,43 v20,43
  Bottom 0.254: v13.26,43.05 13.21,43 | 13.21,43 12.42,42.22 12.42,41.6 JP8.2 12.42,41.45 13.26,40.62 v13.26,38.86 8.76,34.37 8.39,34.37 5.84,31.82 5.84,5.66 6.93,4.57 U$6.P1 | v20,43 13.21,43
VIN_ACTS  (via drill 0.3, 0.35)
  Top 0.254: C16.2 53.95,37.03 53.95,40.84 54.25,41.15 VALVE_C.P1 | PUMP.P1 66.29,41.15 65.91,40.77 65.91,37.11 C3.2 65.84,36.96 65,36.12 61.04,36.12 R13.1 60.88,36.2 60.12,36.96 54.03,36.96 C16.2 | JP4.1 11.43,38.94 11.96,38.94 13.11,37.8 20.99,37.8 22.59,36.2 24.99,36.2 R14.1 25.07,36.04 v26.14,34.98 | VALVE_B.P1 42.29,41.15 v42.29,38 42.29,37.49 41.91,37.11 C15.2 41.91,36.96 42.67,36.2 49,36.2 R16.1 49.07,36.27 49.76,36.96 v49.91,36.96 | v24.31,15.16 23.47,16 IC1.9 23.55,16.15 23.55,18.36 27.96,22.78 27.96,28.8 29.26,30.1 29.26,34.75 | 30.71,36.2 36.2,36.2 | 36.2,36.2 36.96,36.2 R15.1 | 30.71,36.2 29.95,36.96 C14.2 29.95,37.11 30.25,37.41 30.25,41.15 VALVE_A.P1 | 30.71,36.2 29.26,34.75 | 29.26,34.75 v29.03,34.98 | v52.96,36.96 53.8,36.96 C16.2 | 36.2,36.2 36,36.39 v36,37
  Bottom 0.254: v24.31,15.16 26.44,13.03 30.94,13.03 JP2.2 | v29.03,34.98 v26.14,34.98 | v49.91,36.96 v52.96,36.96 | v42.29,38 39.96,38 38.95,39.01 38.01,39.01 v36,37
VIN_FUSED  (via drill 0.3, 0.35)
  Top 0.254: v10.9,40.31 10.67,40.08 10.67,39.01 JP4.2 | F2.2 8.53,41.53 10.21,41.53 Q2.3 10.21,41.6 10.9,42.29 v10.82,42.37 | JP1.1 14.83,46.24 v14.83,46.17
  Bottom 0.254: v10.9,40.31 10.9,40.77 11.58,41.45 JP8.1 11.58,41.6 | v10.82,42.37 11.58,41.6 | v14.83,46.17 11.58,42.92 11.58,41.6
VSYS  (via drill 0.3)
  Top 0.254: v10.9,21.64 10.59,21.95 9.91,21.95 R1.1
  Bottom 0.254: v10.9,21.64 10.9,17.6 16.84,11.66 30.48,11.66 | 30.48,11.66 30.94,12.12 JP2.3 | 30.48,11.66 32.69,9.45 32.69,7.01 U$5.P1 32.84,6.93 33.83,5.94 45.72,5.94 46.71,6.93 50.75,6.93 U$2.P1
WP
  Top 0.152: JP3.2 67.06,4.57 69.49,4.57 69.65,4.42 U4.7

### Text on the board
_tsilk: VIN ≤5V | RESET | Valve A | Valve A | Valve B | Valve C | Pump | Sense B | RobotPatient.com | HB | Sensor 0 | VSYS | 3.3V | Health | Sensor 1 | Analog | SFM3x00 | Sense A | Port A | Ext VIN / Supply | Port B | Port C
_bsilk: JP1: VIN - 5V (≤5V!) | JP4 VIN - ACTS | JP8: Bypass Jumper / (Not recommended) | Ventilations & SoftRobotics / Development Board / RobotPatient Simulators | JP9/10 / SFMx / i2c bus: | JP2: AUX/ACTS/VSYS | JP6/JP7 for SFM Sensor: | JP7: HEAT_GND/GND | JP6: HEAT/5V | RobotPatient.com